# EAGLE design MTX_Tap_an_er_V13_Nopoti_2018_11_30 (EAGLE 7.5.0)

## Sheet 1 of 2
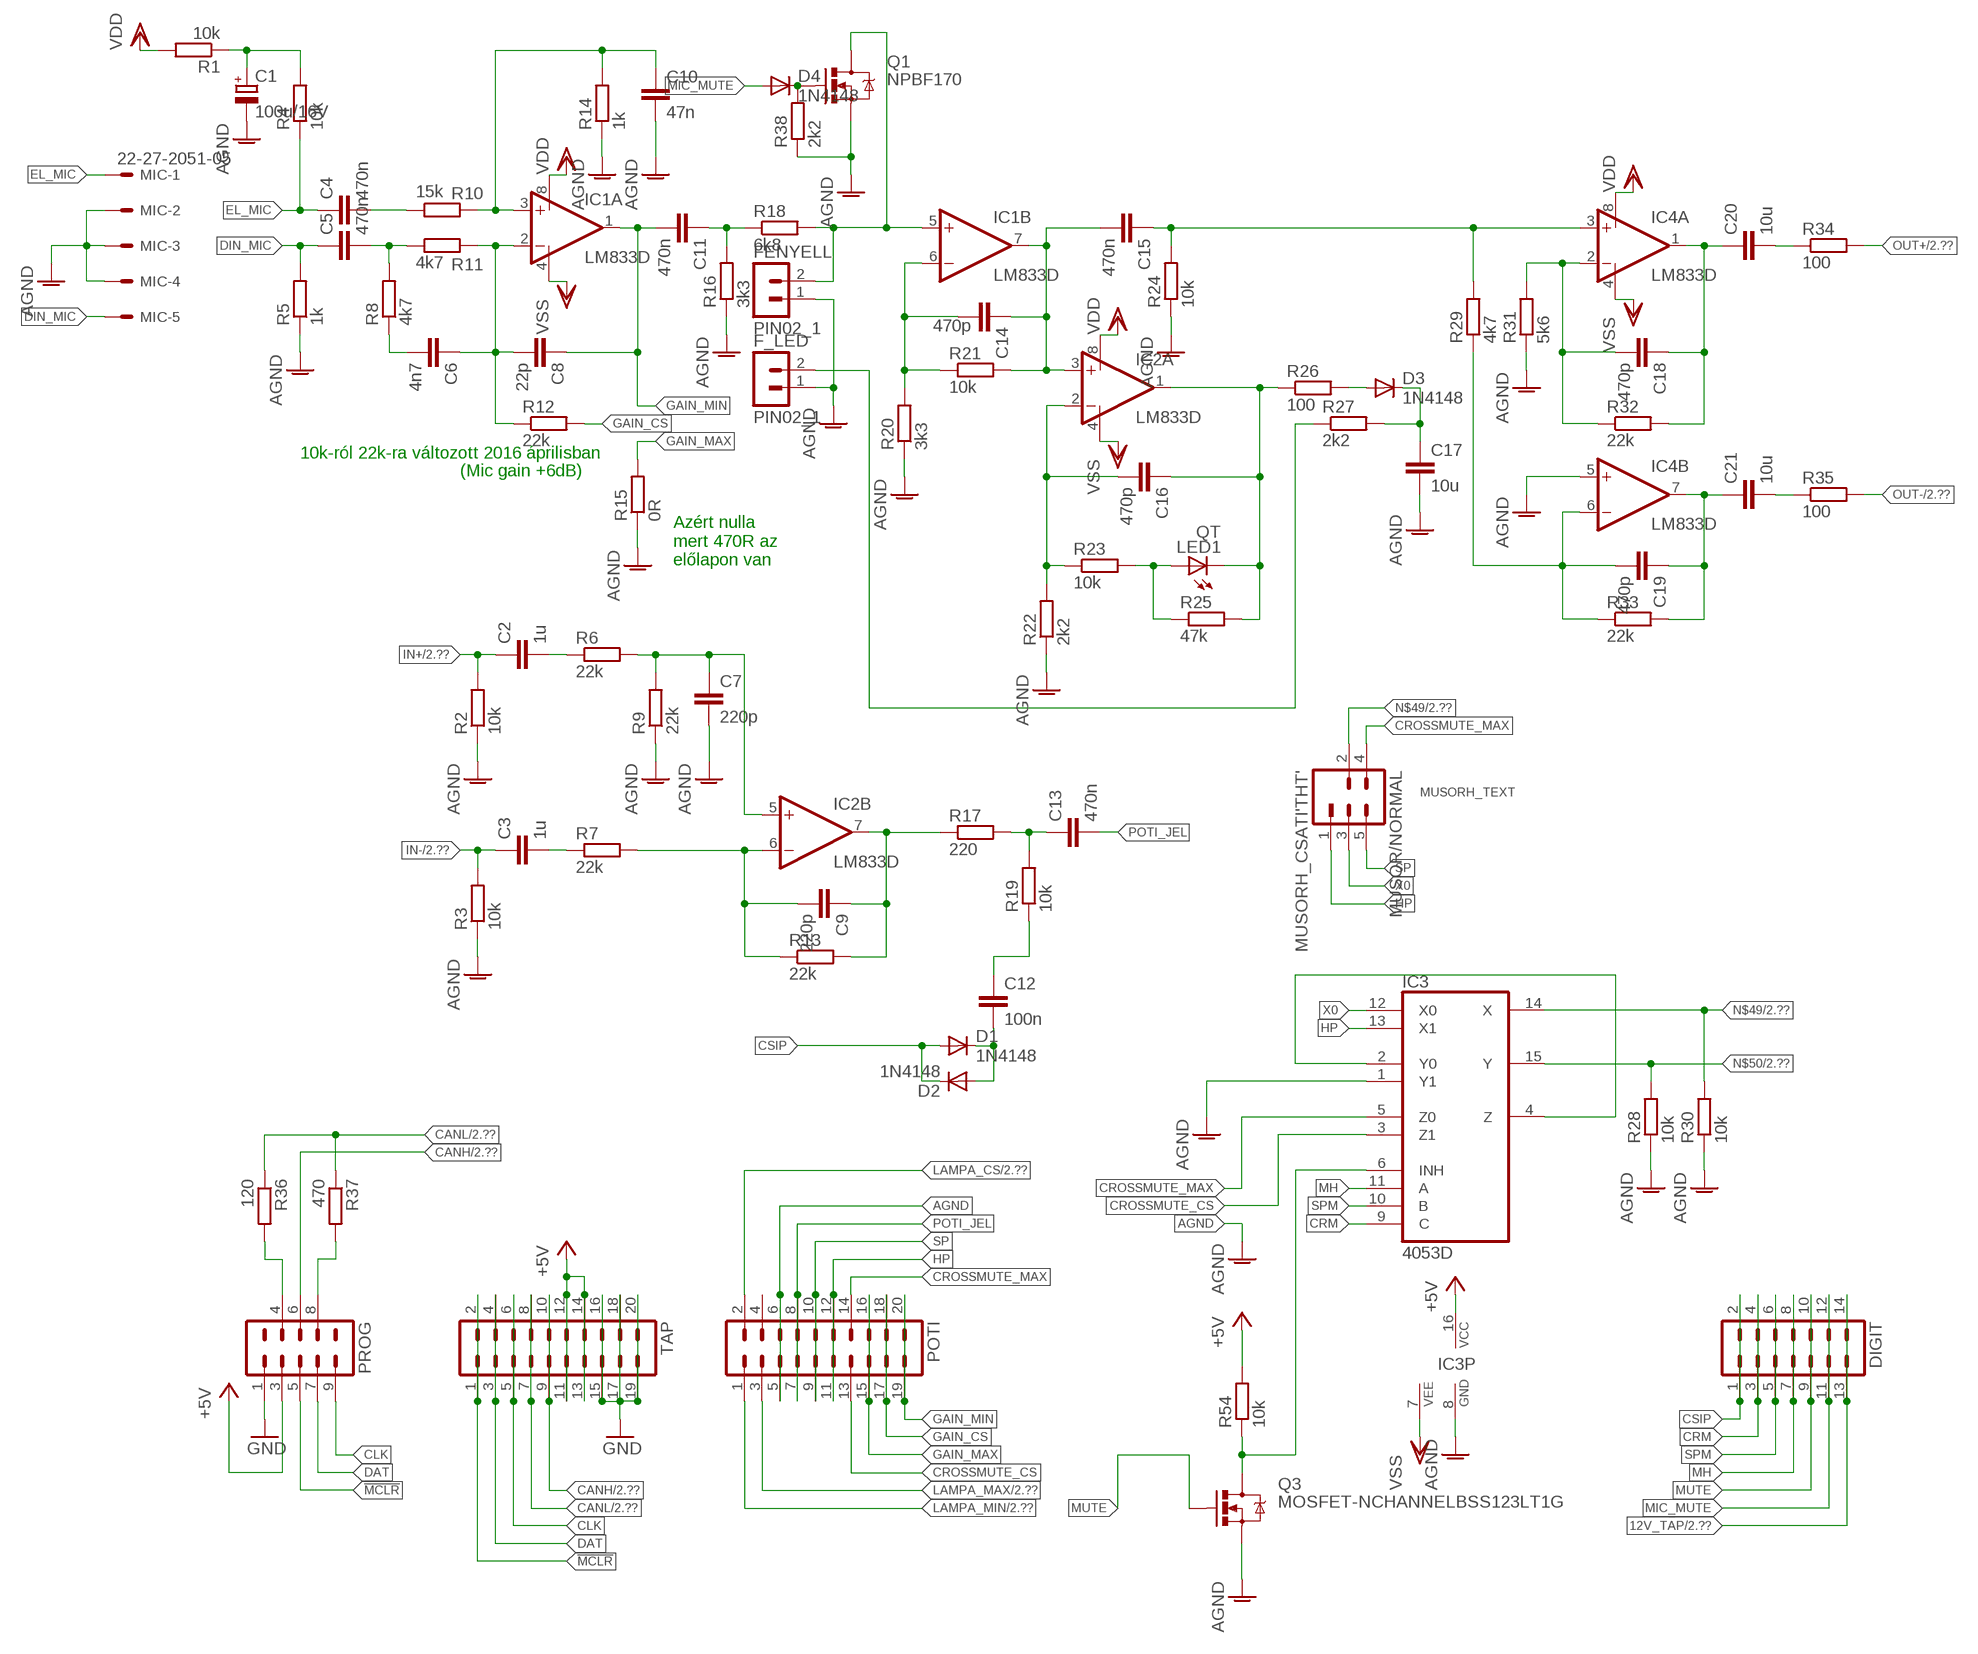
[diagram p0: schematic, sheet 1]

### Parts
C1  100u/16V  CPOL-EUE2.5-5  [E2,5-5]
C2  1u  C-EUC0805  [C0805]
C3  1u  C-EUC0805  [C0805]
C4  470n  C-EUC0805  [C0805]
C5  470n  C-EUC0805  [C0805]
C6  4n7  C-EUC0805  [C0805]
C7  220p  C-EUC0805  [C0805]
C8  22p  C-EUC0805  [C0805]
C9  220p  C-EUC0805  [C0805]
C10  47n  C-EUC0805  [C0805]
C11  470n  C-EUC0805  [C0805]
C12  100n  C-EUC0805  [C0805]
C13  470n  C-EUC0805  [C0805]
C14  470p  C-EUC0805  [C0805]
C15  470n  C-EUC0805  [C0805]
C16  470p  C-EUC0805  [C0805]
C17  10u  C-EUC0805  [C0805]
C18  470p  C-EUC0805  [C0805]
C19  470p  C-EUC0805  [C0805]
C20  10u  C-EUC0805  [C0805]
C21  10u  C-EUC0805  [C0805]
D1  1N4148  DIODE-SOD80C  [SOD80C]
D2  1N4148  DIODE-SOD80C  [SOD80C]
D3  1N4148  DIODE-SOD80C  [SOD80C]
D4  1N4148  DIODE-SOD80C  [SOD80C]
DIGIT  MA07-2  [MA07-2]
F_LED  PIN02_1  [PIN02_1]
FENYELL  PIN02_1  [PIN02_1]
IC1  LM833D  [SO08]
IC2  LM833D  [SO08]
IC3  4053D  [SO16]
IC4  LM833D  [SO08]
LED1  QT  LED3MM  [LED3MM]
MIC  22-27-2051-05  [6410-05]
MUSOR/NORMAL  MUSORH_CSATI'THT'  [MUSORH_CSATI]
POTI  MA10-2  [MA10-2]
PROG  CN_CANTAN  [CN_CANTAN]
Q1  NPBF170  MOSFET-NCHANNELBSS138  [SOT23]
Q3  MOSFET-NCHANNELBSS123LT1G  [SOT23]
R1  10k  R-EU_R0805  [R0805]
R2  10k  R-EU_R0805  [R0805]
R3  10k  R-EU_R0805  [R0805]
R4  10k  R-EU_R0805  [R0805]
R5  1k  R-EU_R0805  [R0805]
R6  22k  R-EU_R0805  [R0805]
R7  22k  R-EU_R0805  [R0805]
R8  4k7  R-EU_R0805  [R0805]
R9  22k  R-EU_R0805  [R0805]
R10  15k  R-EU_R0805  [R0805]
R11  4k7  R-EU_R0805  [R0805]
R12  22k  R-EU_R0805  [R0805]
R13  22k  R-EU_R0805  [R0805]
R14  1k  R-EU_R0805  [R0805]
R15  0R  R-EU_R0805  [R0805]
R16  3k3  R-EU_R0805  [R0805]
R17  220  R-EU_R0805  [R0805]
R18  6k8  R-EU_R0805  [R0805]
R19  10k  R-EU_R0805  [R0805]
R20  3k3  R-EU_R0805  [R0805]
R21  10k  R-EU_R0805  [R0805]
R22  2k2  R-EU_R0805  [R0805]
R23  10k  R-EU_R0805  [R0805]
R24  10k  R-EU_R0805  [R0805]
R25  47k  R-EU_R0805  [R0805]
R26  100  R-EU_R0805  [R0805]
R27  2k2  R-EU_R0805  [R0805]
R28  10k  R-EU_R0805  [R0805]
R29  4k7  R-EU_R0805  [R0805]
R30  10k  R-EU_R0805  [R0805]
R31  5k6  R-EU_R0805  [R0805]
R32  22k  R-EU_R0805  [R0805]
R33  22k  R-EU_R0805  [R0805]
R34  100  R-EU_R0805  [R0805]
R35  100  R-EU_R0805  [R0805]
R36  120  R-EU_R0805  [R0805]
R37  470  R-EU_R0805  [R0805]
R38  2k2  R-EU_R0805  [R0805]
R54  10k  R-EU_R0805  [R0805]
TAP  MA10-2  [MA10-2]
U$1  MUSORH_TEXT  [MUSORH_TEXT]

### Nets
1.: C9.1 IC2.7(B:OUT) R13.2 R17.1
12V_TAP: DIGIT.13 DIGIT.14 ; also sheet 2
!MCLR: PROG.5 TAP.1 TAP.2
+5V: IC3.16(VCC) PROG.3 R54.2 TAP.11 TAP.12 TAP.13 TAP.14 ; also sheet 2
AGND: C1.- C7.2 C10.2 C17.2 F_LED.1 FENYELL.1 IC3.1(Y1) IC3.8(GND) IC4.5(B:+IN) MIC.2 MIC.3 MIC.4 POTI.5 POTI.6 Q1.2(S) Q3.2(S) R2.1 R3.1 R5.1 R9.1 R14.1 R15.1 R16.1 R20.1 R22.1 R24.1 R28.1 R30.1 R31.1 R38.1 ; also sheet 2
CANH: PROG.6 TAP.9 TAP.10 ; also sheet 2
CANL: R36.1 R37.1 TAP.7 TAP.8 ; also sheet 2
CLK: PROG.9 TAP.5 TAP.6
CRM: DIGIT.3 DIGIT.4 IC3.9(C)
CROSSMUTE_CS: IC3.3(Z1) POTI.13
CROSSMUTE_MAX: IC3.5(Z0) MUSOR/NORMAL.4 POTI.14
CSIP: D1.A D2.C DIGIT.1 DIGIT.2
DAT: PROG.7 TAP.3 TAP.4
DIN_MIC: C5.1 MIC.5 R5.2
EL_MIC: C4.1 MIC.1 R4.1
GAIN_CS: POTI.17 POTI.18 R12.2
GAIN_MAX: POTI.15 POTI.16 R15.2
GAIN_MIN: C8.1 C11.2 IC1.1(A:OUT) POTI.19 POTI.20
GND: PROG.1 TAP.15 TAP.16 TAP.17 TAP.18 TAP.19 TAP.20 ; also sheet 2
HP: IC3.13(X1) MUSOR/NORMAL.1 POTI.11 POTI.12
IN+: C2.1 R2.2 ; also sheet 2
IN-: C3.1 R3.2 ; also sheet 2
LAMPA_CS: POTI.2 ; also sheet 2
LAMPA_MAX: POTI.3 ; also sheet 2
LAMPA_MIN: POTI.1 ; also sheet 2
MH: DIGIT.7 DIGIT.8 IC3.11(A)
MIC_MUTE: D4.A DIGIT.11 DIGIT.12
MUTE: DIGIT.9 DIGIT.10 Q3.1(G)
N$1: C1.+ R1.1 R4.2
N$2: C4.2 R10.1
N$3: C5.2 R8.2 R11.1
N$4: C10.1 IC1.3(A:+IN) R10.2 R14.2
N$5: C6.1 C8.2 IC1.2(A:-IN) R11.2 R12.1
N$8: C6.2 R8.1
N$9: FENYELL.2 IC1.5(B:+IN) Q1.3(D) R18.2
N$12: IC3.2(Y0) IC3.4(Z)
N$13: C11.1 R16.2 R18.1
N$14: C18.2 IC4.2(A:-IN) R31.2 R32.1
N$15: C18.1 C20.1 IC4.1(A:OUT) R32.2
N$16: C14.2 IC1.6(B:-IN) R20.2 R21.1
N$17: C14.1 C15.2 IC1.7(B:OUT) IC2.3(A:+IN) R21.2
N$18: C16.2 IC2.2(A:-IN) R22.2 R23.1
N$19: C19.2 IC4.6(B:-IN) R29.1 R33.1
N$20: LED1.A R23.2 R25.1
N$21: C16.1 IC2.1(A:OUT) LED1.K(C) R25.2 R26.1
N$22: D3.A R26.2
N$23: C17.1 D3.C R27.2
N$24: F_LED.2 R27.1
N$25: C15.1 IC4.3(A:+IN) R24.2 R29.2
N$26: C19.1 C21.1 IC4.7(B:OUT) R33.2
N$27: C21.2 R35.1
N$28: C20.2 R34.1
N$29: C2.2 R6.1
N$30: D4.C Q1.1(G) R38.2
N$31: C7.1 IC2.5(B:+IN) R6.2 R9.2
N$32: C3.2 R7.1
N$35: C12.2 D1.C D2.A
N$36: C9.2 IC2.6(B:-IN) R7.2 R13.1
N$39: C13.1 R17.2 R19.2
N$40: C12.1 R19.1
N$49: IC3.14(X) MUSOR/NORMAL.2 R30.2 ; also sheet 2
N$50: IC3.15(Y) R28.2 ; also sheet 2
N$51: PROG.8 R37.2
N$57: PROG.4 R36.2
N$59: IC3.6(INH) Q3.3(D) R54.1
OUT+: R34.2 ; also sheet 2
OUT-: R35.2 ; also sheet 2
POTI_JEL: C13.2 POTI.7 POTI.8
SP: MUSOR/NORMAL.5 POTI.9 POTI.10
SPM: DIGIT.5 DIGIT.6 IC3.10(B)
VDD: IC1.8(P:V+) IC2.8(P:V+) IC4.8(P:V+) R1.2 ; also sheet 2
VSS: IC1.4(P:V-) IC2.4(P:V-) IC3.7(VEE) IC4.4(P:V-) ; also sheet 2
X0: IC3.12(X0) MUSOR/NORMAL.3
Unconnected: POTI.4

### Notes on the sheet
- 10k-ról 22k-ra változott 2016 áprilisban
- (Mic gain +6dB)
- Azért nulla
  mert 470R az 
  előlapon van

## Sheet 2 of 2
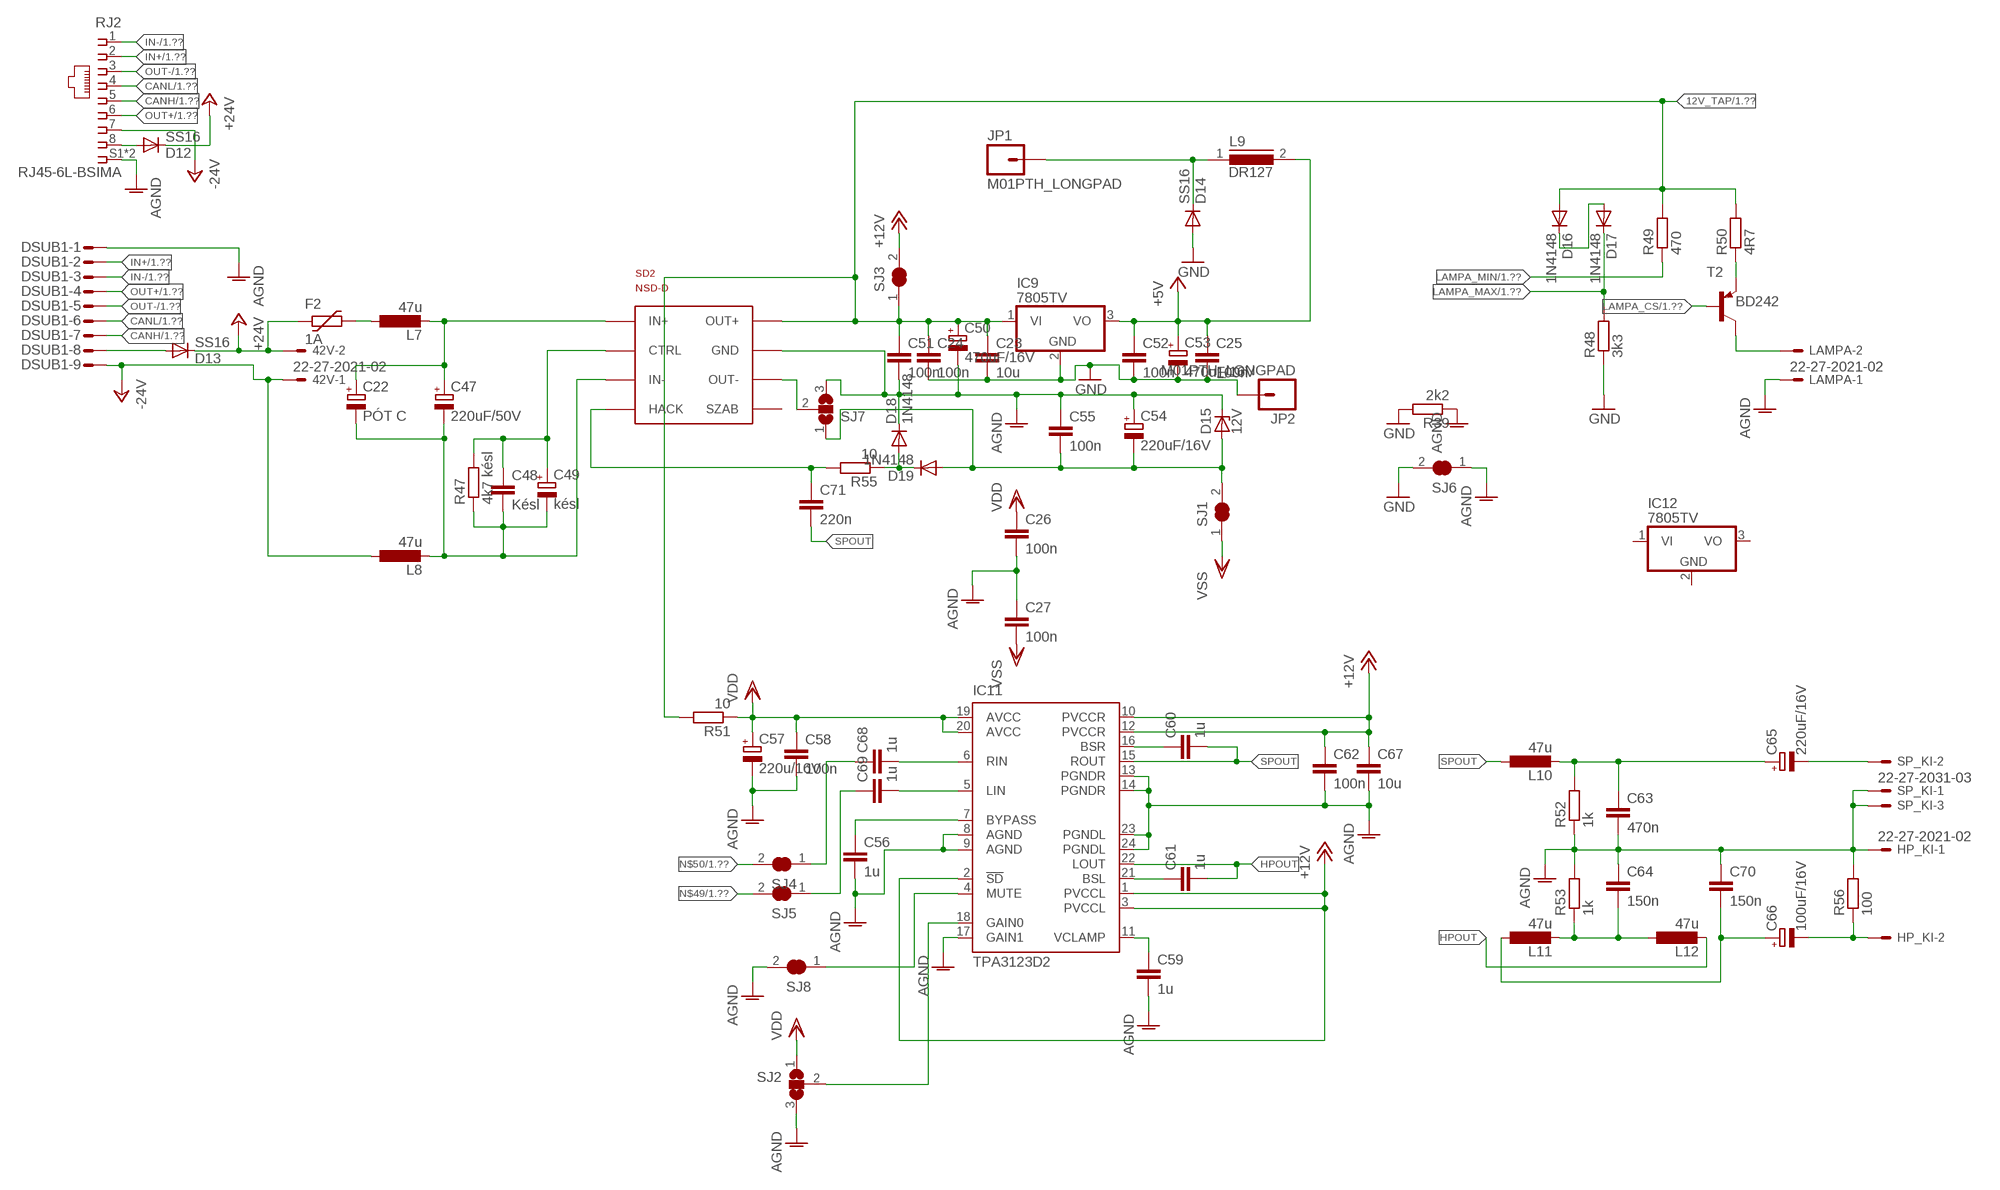
[diagram p1: schematic, sheet 2]

### Parts
42V  22-27-2021-02  [6410-02]
C22  PÓT C  CPOL-EUE3.5-8  [E3,5-8]
C23  10u  C-EUC0805  [C0805]
C24  100n  C-EUC0805  [C0805]
C25  100n  C-EUC0805  [C0805]
C26  100n  C-EUC0805  [C0805]
C27  100n  C-EUC0805  [C0805]
C47  220uF/50V  CPOL-EUE3.5-8  [E3,5-8]
C48  Késl  C-EUC0805  [C0805]
C49  késl  CPOL-EUE2.5-5  [E2,5-5]
C50  470uF/16V  CPOL-EUE3.5-8  [E3,5-8]
C51  100n  C-EUC0805  [C0805]
C52  100n  C-EUC0805  [C0805]
C53  470uF/16V  CPOL-EUE3.5-8  [E3,5-8]
C54  220uF/16V  CPOL-EUE2.5-7  [E2,5-7]
C55  100n  C-EUC0805  [C0805]
C56  1u  C-EUC0805  [C0805]
C57  220u/16V  CPOL-EUE2.5-7  [E2,5-7]
C58  100n  C-EUC0805  [C0805]
C59  1u  C-EUC0805  [C0805]
C60  1u  C-EUC0805  [C0805]
C61  1u  C-EUC0805  [C0805]
C62  100n  C-EUC0805  [C0805]
C63  470n  C-EUC0805  [C0805]
C64  150n  C-EUC0805  [C0805]
C65  220uF/16V  CPOL-EUE2.5-7  [E2,5-7]
C66  100uF/16V  CPOL-EUE2.5-6  [E2,5-6]
C67  10u  C-EUC0805  [C0805]
C68  1u  C-EUC0805  [C0805]
C69  1u  C-EUC0805  [C0805]
C70  150n  C-EUC0805  [C0805]
C71  220n  C-EUC0805  [C0805]
D12  SS16  DIODE-DO-214AC  [DO-214AC]
D13  SS16  DIODE-DO-214AC  [DO-214AC]
D14  SS16  DIODE-DO-214AC  [DO-214AC]
D15  12V  ZENER-DIODESOD80C  [SOD80C]
D16  1N4148  DIODE-SOD80C  [SOD80C]
D17  1N4148  DIODE-SOD80C  [SOD80C]
D18  1N4148  DIODE-SOD80C  [SOD80C]
D19  1N4148  DIODE-SOD80C  [SOD80C]
DSUB1  M09-182S  [182-009-MALE]
F2  1A  FUSE_PTC-1812  [PTC1812L]
HP_KI  22-27-2021-02  [6410-02]
IC9  7805TV  [TO220V]
IC11  TPA3123D2  [PWP-TSSOP24]
IC12  7805TV  [TO220V]
JP1  M01PTH_LONGPAD  [1X01_LONGPAD]
JP2  M01PTH_LONGPAD  [1X01_LONGPAD]
L7  47u  L-EUPIS2816  [PIS2816]
L8  47u  L-EUPIS2816  [PIS2816]
L9  DR127  [DR127]
L10  47u  L-EUPIS2816  [PIS2816]
L11  47u  L-EUPIS2816  [PIS2816]
L12  47u  L-EUPIS2816  [PIS2816]
LAMPA  22-27-2021-02  [6410-02]
R39  2k2  R-EU_R0805  [R0805]
R47  4k7 késl  R-EU_R0805  [R0805]
R48  3k3  R-EU_R0805  [R0805]
R49  470  R-EU_R0805  [R0805]
R50  4R7  R-EU_R0805  [R0805]
R51  10  R-EU_R1210  [R1210]
R52  1k  R-EU_R0805  [R0805]
R53  1k  R-EU_R0805  [R0805]
R55  10  R-EU_R0805  [R0805]
R56  100  R-EU_R0805  [R0805]
RJ2  RJ45-6L-BSIMA  [RJ45]
SD2  NSD-D  [NSD-D]
SJ1  SOLDERJUMPER_CLOSED  [SOLDERJUMPER_CLOSEDWIRE]
SJ2  SJ2WW12  [SJ_2W_12]
SJ3  SOLDERJUMPER_CLOSED  [SOLDERJUMPER_CLOSEDWIRE]
SJ4  SOLDERJUMPER_CLOSED  [SOLDERJUMPER_CLOSEDWIRE]
SJ5  SOLDERJUMPER_CLOSED  [SOLDERJUMPER_CLOSEDWIRE]
SJ6  SOLDERJUMPER_CLOSED  [SOLDERJUMPER_CLOSEDWIRE]
SJ7  SJ2WW23  [SJ_2W_23]
SJ8  SOLDERJUMPER_CLOSED  [SOLDERJUMPER_CLOSEDWIRE]
SP_KI  22-27-2031-03  [6410-03]
T2  BD242  -PNP-TO220V  [TO220V]

### Nets
12V_TAP: C23.1 C24.1 C50.+ C51.1 D16.A IC9.1(VI) R49.2 R50.2 R51.2 SD2.OUT+ SJ3.1 ; also sheet 1
+5V: C25.1 C52.1 C53.+ IC9.3(VO) L9.2 ; also sheet 1
+12V: C62.1 C67.1 IC11.1(PVCCL) IC11.2(!SD) IC11.3(PVCCL) IC11.10(PVCCR) IC11.12(PVCCR) SJ3.2
+24V: 42V.2 D12.1(C) D13.1(C) F2.1
-24V: 42V.1 DSUB1.9 L8.1 RJ2.7
AGND: C26.2 C27.1 C50.- C51.2 C54.+ C55.1 C56.2 C57.- C58.2 C59.2 C62.2 C63.2 C64.1 C67.2 C70.1 D15.C D18.C DSUB1.1 HP_KI.1 IC11.8(AGND) IC11.9(AGND) IC11.13(PGNDR) IC11.14(PGNDR) IC11.17(GAIN1) IC11.23(PGNDL) IC11.24(PGNDL) LAMPA.1 R39.1 R52.1 R53.2 R56.2 RJ2.S1(S) RJ2.S2(S) SD2.COMMON(GND) SJ2.3 SJ6.1 SJ7.3 SJ8.2 SP_KI.1 SP_KI.3 ; also sheet 1
CANH: DSUB1.7 RJ2.5 ; also sheet 1
CANL: DSUB1.6 RJ2.4 ; also sheet 1
GND: C23.2 C24.2 C25.2 C52.2 C53.- D14.2(A) IC9.2(GND) JP2.1 R39.2 R48.1 SJ6.2 ; also sheet 1
HPIN_X: C69.1 SJ5.1
HPOUT: C61.2 IC11.22(LOUT) L12.2
IN+: DSUB1.2 RJ2.2 ; also sheet 1
IN-: DSUB1.3 RJ2.1 ; also sheet 1
LAMPA_CS: T2.1(B) ; also sheet 1
LAMPA_MAX: D17.C R48.2 ; also sheet 1
LAMPA_MIN: R49.1 ; also sheet 1
N$6: C54.- C55.2 D15.A D19.A SJ1.2 SJ7.1
N$7: D12.2(A) RJ2.8
N$34: C65.- SP_KI.2
N$46: SD2.OUT- SJ7.2
N$49: SJ5.2 ; also sheet 1
N$50: SJ4.2 ; also sheet 1
N$55: C71.1 R55.2 SD2.HACK
N$71: D13.2(A) DSUB1.8
N$72: F2.2 L7.1
N$74: C22.+ C47.+ L7.2 SD2.INPUT+(IN+)
N$75: C48.1 C49.+ R47.2 SD2.CONTROL(CTRL)
N$76: C22.- C47.- C48.2 C49.- L8.2 R47.1 SD2.INPUT-(IN-)
N$77: D14.1(C) JP1.1 L9.1
N$78: R50.1 T2.3(E)
N$80: D16.C D17.A
N$81: LAMPA.2 T2.2(C)
N$82: C56.1 IC11.7(BYPASS)
N$83: C59.1 IC11.11(VCLAMP)
N$84: C61.1 IC11.21(BSL)
N$85: C60.1 IC11.16(BSR)
N$86: C63.1 C65.+ L10.2 R52.2
N$87: C64.2 L11.2 L12.1 R53.1
N$89: C66.- HP_KI.2 R56.1
N$90: C68.2 IC11.6(RIN)
N$91: C69.2 IC11.5(LIN)
N$92: IC11.18(GAIN0) SJ2.2
N$93: IC11.4(MUTE) SJ8.1
N$94: D18.A D19.C R55.1
N$95: C66.+ C70.2 L11.1
OUT+: DSUB1.4 RJ2.6 ; also sheet 1
OUT-: DSUB1.5 RJ2.3 ; also sheet 1
SPIN_X: C68.1 SJ4.1
SPOUT: C60.2 C71.2 IC11.15(ROUT) L10.1
VDD: C26.1 C57.+ C58.1 IC11.19(AVCC) IC11.20(AVCC) R51.1 SJ2.1 ; also sheet 1
VSS: C27.2 SJ1.1 ; also sheet 1
Unconnected: IC12.1(VI) IC12.2(GND) IC12.3(VO) SD2.SZAB

## Library data of the parts
42V HP_KI LAMPA = con-molex:22-?-02: CONNECTOR wire to board 2.54 mm (.1 inch) pitch header; OC_FARNELL: unknown; OC_NEWARK: unknown
C1 C22 C47 C49 C50 C53 C54 C57 C65 C66 = rcl:CPOL-EU: POLARIZED CAPACITOR, European symbol
C2-C21 C23-C27 C48 C51 C52 C55 C56 C58-C64 C67-C71 = rcl:C-EU: CAPACITOR, European symbol
D1-D4 D16-D19 = diode:DIODE-: DIODE
D12-D14 = dp_devices:DIODE: Various Diode Packages
D15 = diode:ZENER-DIODE: Z-Diode
DIGIT = con-lstb:MA07-2: PIN HEADER; OC_FARNELL: unknown; OC_NEWARK: unknown
DSUB1 = con-subd:M09?S: SUB-D; OC_FARNELL: unknown; OC_NEWARK: unknown
F2 = dp_devices:FUSE_PTC: Resettable PTC; TME: BSMD-T1.0A
F_LED FENYELL = Cf_Csatl:PIN02_1
IC1 IC2 IC4 = linear:LM833: OP AMP
IC3 = 40xx:4053: Triple 2-channel ANALOG MULTIPLEXER
IC9 IC12 = linear:78*: Positive VOLTAGE REGULATOR Source: http://cache.national.com/ds/LM/LM78L05.pdf http://www.fairchildsemi.com/ds/LM/LM7805.pdf
IC11 = texas:TPA3123D2: 25-W STEREO CLASS-D AUDIO POWER AMPLIFIER Please INVOKE gate EXP, set DRC-Clearance | Same signals | SMD - SMD = 0 Source: http://focus.ti.com/lit/ds/symlink/tpa3123d2.pdf; MPN: TPA3123D2PWP; OC_FARNELL: 1632099; OC_NEWARK: 53M3994
JP1 JP2 = SparkFun-Connectors:M01: Header 1 Standard 1-pin 0.1" header. Use with straight break away headers (SKU : PRT-00116), right angle break away headers (PRT-00553), swiss pins (PRT-00743), machine pins (PRT-00117), and female headers (PRT-00115).
L7 L8 L10-L12 = rcl:L-EU: INDUCTOR, European symbol
L9 = inductors:DR127: High Power Density, High Efficiency, Shielded Inductors Source: coiltronics_dr_series.pdf
LED1 = led:LED: LED OSRAM: - CHIPLED LG R971, LG N971, LY N971, LG Q971, LY Q971, LO R971, LY R971 LH N974, LH R974 LS Q976, LO Q976, LY Q976 LO Q996 - Hyper CHIPLED LW Q18S LB Q993, LB Q99A, LB R99A - SideLED LS A670, LO A670, LY A670, LG A670, LP A670 LB A673, LV A673, LT A673, LW A673 LH A674 LY A675 LS A676, LA A676, LO A676, LY A676, LW A676 LS A679, LY A679, LG A679 - Hyper Micro SIDELED® LS Y876, LA Y876, LO Y876, LY Y876 LT Y87S - SmartLED LW L88C, LW L88S LB L89C, LB L89S, LG L890 LS L89K, LO L89K, LY L89K LS L896, LA L896, LO L896, LY L896 - TOPLED LS T670, LO T670, LY T670, LG T670, LP T670 LSG T670, LSP T670, LSY T670, LOP T670, LYG T670 LG T671, LOG T671, LSG T671 LB T673, LV T673, LT T673, LW T673 LH T674 LS T676, LA T676, LO T676, LY T676, LB T676, LH T676, LSB T676, LW T676 LB T67C, LV T67C, LT T67C, LS T67K, LO T67K, LY T67K, LW E67C LS E67B, LA E67B, LO E67B, LY E67B, LB E67C, LV E67C, LT E67C LW T67C LS T679, LY T679, LG T679 LS T770, LO T770, LY T770, LG T770, LP T770 LB T773, LV T773, LT T773, LW T773 LH T774 LS E675, LA E675, LY E675, LS T675 LS T776, LA T776, LO T776, LY T776, LB T776 LHGB T686 LT T68C, LB T68C - Hyper Mini TOPLED® LB M676 - Mini TOPLED Santana® LG M470 LS M47K, LO M47K, LY M47K Source: http://www.osram.convergy.de LUXEON: - LUMILED® LXK2-PW12-R00, LXK2-PW12-S00, LXK2-PW14-U00, LXK2-PW14-V00 LXK2-PM12-R00, LXK2-PM12-S00, LXK2-PM14-U00 LXK2-PE12-Q00, LXK2-PE12-R00, LXK2-PE12-S00, LXK2-PE14-T00, LXK2-PE14-U00 LXK2-PB12-K00, LXK2-PB12-L00, LXK2-PB12-M00, LXK2-PB14-N00, LXK2-PB14-P00, LXK2-PB14-Q00 LXK2-PR12-L00, LXK2-PR12-M00, LXK2-PR14-Q00, LXK2-PR14-R00 LXK2-PD12-Q00, LXK2-PD12-R00, LXK2-PD12-S00 LXK2-PH12-R00, LXK2-PH12-S00 LXK2-PL12-P00, LXK2-PL12-Q00, LXK2-PL12-R00 Source: www.luxeon.com KINGBRIGHT: KA-3528ASYC Source: www.kingbright.com
MIC = con-molex:22-?-05: CONNECTOR wire to board 2.54 mm (.1 inch) pitch header; OC_FARNELL: unknown; OC_NEWARK: unknown
MUSOR/NORMAL = narval:MUSORH_CSATI
POTI TAP = con-lstb:MA10-2: PIN HEADER; OC_FARNELL: unknown; OC_NEWARK: unknown
PROG = narval:CN_CANTAN: HARTING
Q1 = SparkFun-DiscreteSemi:MOSFET-NCHANNEL: Common NMOSFET Parts MFG P/N Store ID Prod ID FDD8780 TRANS-09984 SI7820DN TRANS-11055 FDS6630A IC-08089 2N7002PW TRANS-11151 FQP30N06L COM-10213 TRANS-10060 BSS123LT1G TRANS-08345 BSS138 TRANS-00830 BS170 2N7000; PROD_ID: TRANS-00830
Q3 = SparkFun-DiscreteSemi:MOSFET-NCHANNEL: Common NMOSFET Parts MFG P/N Store ID Prod ID FDD8780 TRANS-09984 SI7820DN TRANS-11055 FDS6630A IC-08089 2N7002PW TRANS-11151 FQP30N06L COM-10213 TRANS-10060 BSS123LT1G TRANS-08345 BSS138 TRANS-00830 BS170 2N7000; PROD_ID: TRANS-08345
R1-R39 R47-R56 = rcl:R-EU_: RESISTOR, European symbol
RJ2 = Cf_Csatl:RJ45: CORCOM Modular RJ Jacks No Shield Source: www.tycoelectronics.com .. ENG_DS_1654001_1099_RJ_L_0507.pdf; MPN: RJ45-6L-B; OC_FARNELL: unknown; OC_NEWARK: 16R6090
SD2 = meanwell:NSD-D
SJ1 SJ3-SJ6 SJ8 = microbuilder:SOLDERJUMPER_CLOSED: Solder Jumper - Closed These solder jumpers are closed by default CLOSEDWIRE - 10 mil trace between pads that can be cut and resoldered later CLOSEDPERM - 63 mil trace between pads for a permanent connection (used to 'bridge' two signals, a shameless hack for Eagle). Can double as a test point as well (no cream layer)
SJ2 SJ7 = jumper:SJ2W: SMD solder JUMPER
SP_KI = con-molex:22-?-03: CONNECTOR wire to board 2.54 mm (.1 inch) pitch header; OC_FARNELL: unknown; OC_NEWARK: unknown
T2 = transistor:*-PNP-: PNP Transistror
U$1 = narval:MUSORH_TEXT

## Board
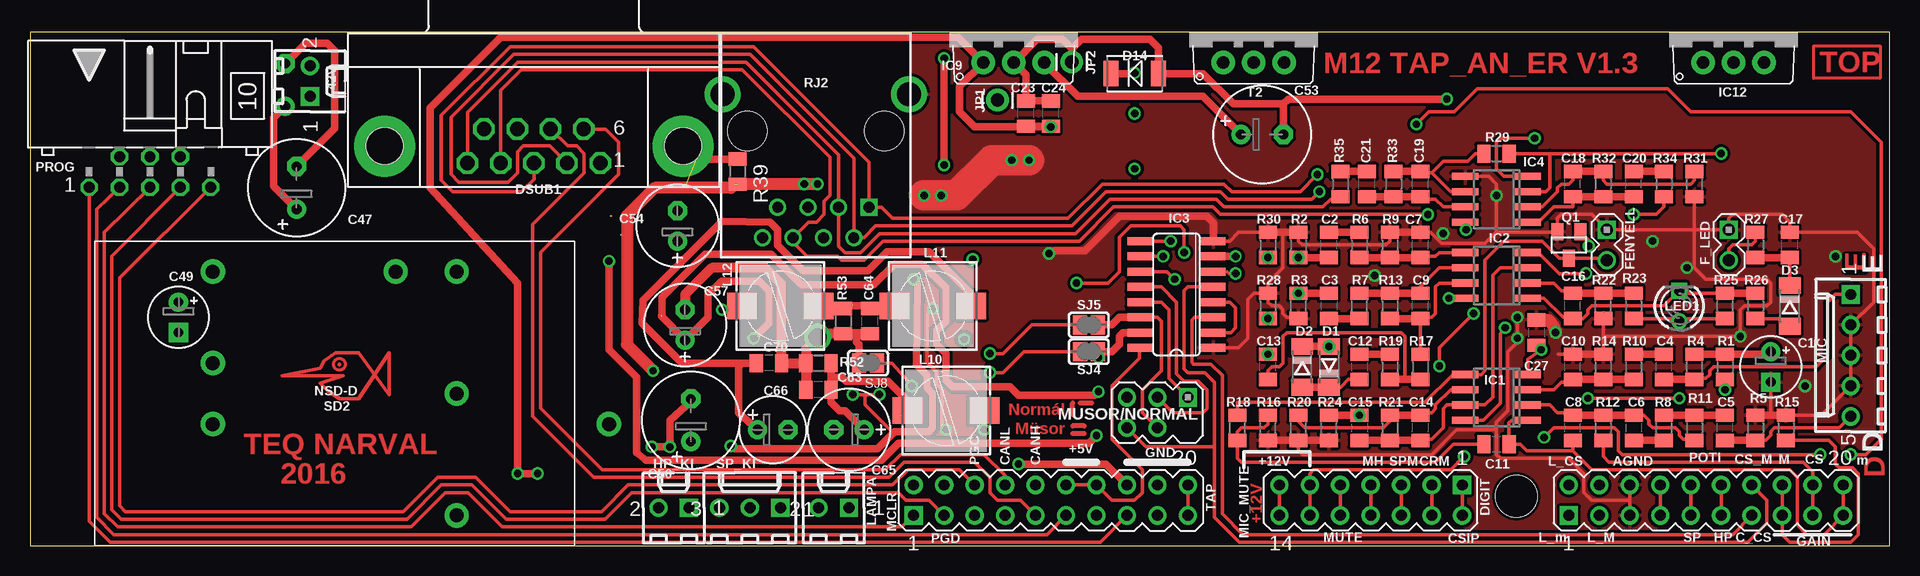
[diagram p2: board, top side]
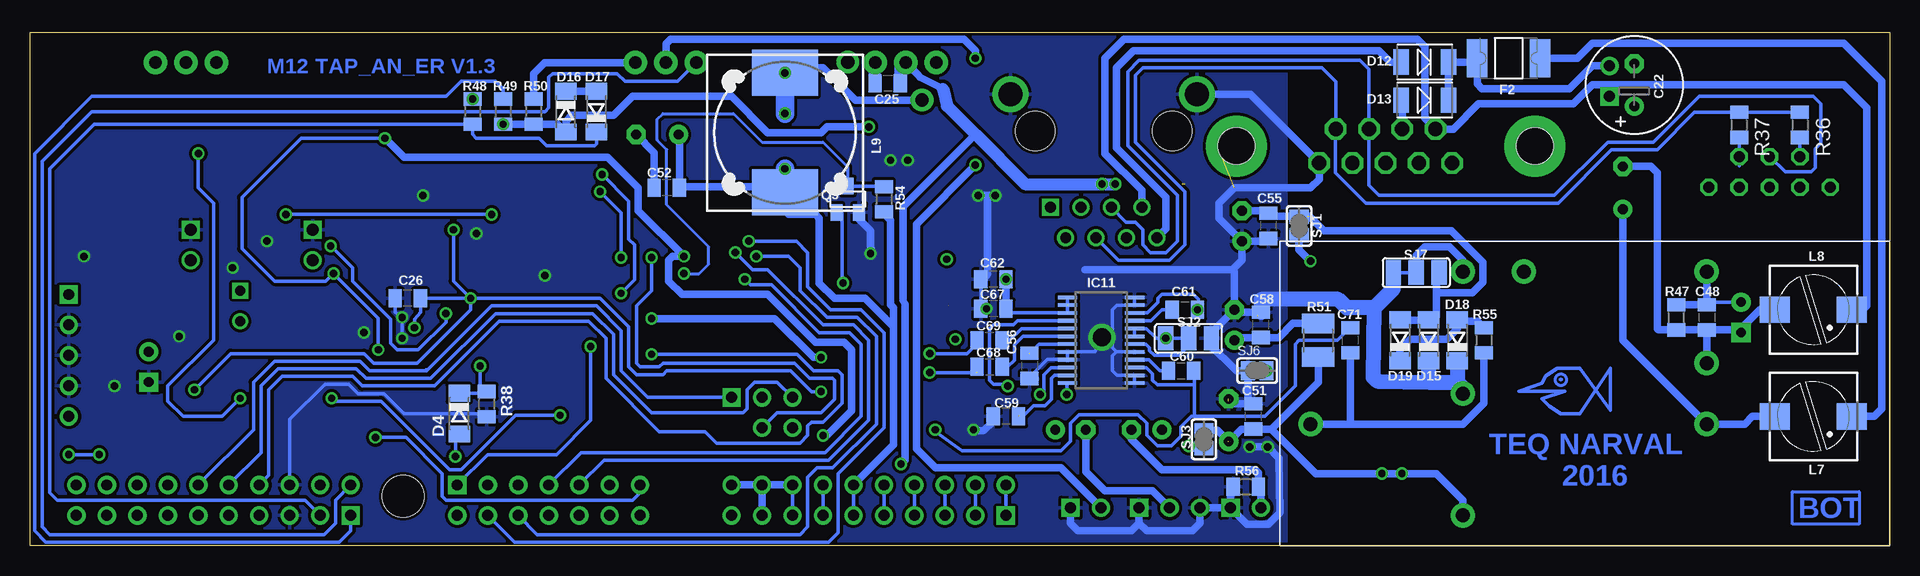
[diagram p3: board, bottom side, seen from below]

Size 155 x 42.83 mm. Coordinates in mm from the lower left corner, seen from the top.
Outline: 0,0 155,0 155,42.83 0,42.83 0,0
Copper layers (1*16): Top 0.035mm / dielectric 1.5mm / Bottom 0.035mm
Design rules "default": minimum track width 10mil, minimum drill 24mil, track to track 10mil, track to pad 10mil, pad to pad 10mil, via to via 10mil, smd to smd 10mil, copper to edge 10mil, drill to drill 10mil, minimum pad ring 10mil, minimum via ring 8mil, stop-mask expansion 4mil, vias tented up to drill 0mil, thermal gap 10mil
Holes 3.5 mm at 123.91,4.13

### Footprints (pad centres in the part's own frame; a part is rotated, then mirrored left to right if it is on the bottom)
6410-02 = drill 0.914 pad 1.524 square: 1 1.27,0 | drill 0.914 pad 1.524: 2 -1.27,0
E2,5-5 = drill 0.813 pad 1.6: + -1.27,0 | drill 0.813 pad 1.6 square: - 1.27,0
C0805 = smd 1.1 x 1.5: 1 -1.05,0; 2 1.05,0
E3,5-8 = drill 0.813 pad 1.6: + -1.778,0 | drill 0.813 pad 1.6 octagon: - 1.778,0
E2,5-7 = drill 0.813 pad 1.6: + -1.27,0 | drill 0.813 pad 1.6 octagon: - 1.27,0
E2,5-6 = drill 0.813 pad 1.6: + -1.27,0 | drill 0.813 pad 1.6 octagon: - 1.27,0
SOD80C = smd 1.4 x 1.8: A 1.7,0; C -1.7,0
DO-214AC = smd 1.27 x 2.1: 1 -1.98,0; 2 1.98,0
MA07-2 = drill 0.914 pad 1.524 square: 1 -7.62,-1.27 | drill 0.914 pad 1.524: 2 -7.62,1.27; 3 -5.08,-1.27; 4 -5.08,1.27; 5 -2.54,-1.27; 6 -2.54,1.27; 7 0,-1.27; 8 0,1.27; 9 2.54,-1.27; 10 2.54,1.27; 11 5.08,-1.27; 12 5.08,1.27; 13 7.62,-1.27; 14 7.62,1.27
182-009-MALE = drill 1.194 pad 1.524 octagon: 1 -5.537,10.923; 2 -2.769,10.923; 3 0,10.923; 4 2.769,10.923; 5 5.537,10.923; 6 -4.153,8.08; 7 -1.384,8.08; 8 1.384,8.08; 9 4.153,8.08 | drill 3.048 pad 5.08: P$1 -12.446,9.501; P$2 12.446,9.501 | hole 3.048: -12.446,9.501; 12.446,9.501
PTC1812L = smd 1.7 x 3.15: 1 -2.62,0; 2 2.62,0
PIN02_1 = drill 1.016 square: 1 0,0 | drill 1.016: 2 2.54,0
SO08 = smd 0.6 x 2.2: 1 -1.905,-2.6; 2 -0.635,-2.6; 3 0.635,-2.6; 4 1.905,-2.6; 5 1.905,2.6; 6 0.635,2.6; 7 -0.635,2.6; 8 -1.905,2.6
SO16 = smd 0.66 x 2.032: 1 -4.445,-3.073; 2 -3.175,-3.073; 3 -1.905,-3.073; 4 -0.635,-3.073; 5 0.635,-3.073; 6 1.905,-3.073; 7 3.175,-3.073; 8 4.445,-3.073; 9 4.445,3.073; 10 3.175,3.073; 11 1.905,3.073; 12 0.635,3.073; 13 -0.635,3.073; 14 -1.905,3.073; 15 -3.175,3.073; 16 -4.445,3.073
TO220V = drill 1.016 pad 1.93: 1 -2.54,-2.54; 2 0,-2.54; 3 2.54,-2.54
PWP-TSSOP24 = smd 1.6 x 0.3: 1 -2.8,3.575; 2 -2.8,2.925; 3 -2.8,2.275; 4 -2.8,1.625; 5 -2.8,0.975; 6 -2.8,0.325; 7 -2.8,-0.325; 8 -2.8,-0.975; 9 -2.8,-1.625; 10 -2.8,-2.275; 11 -2.8,-2.925; 12 -2.8,-3.575; 13 2.8,-3.575; 14 2.8,-2.925; 15 2.8,-2.275; 16 2.8,-1.625; 17 2.8,-0.975; 18 2.8,-0.325; 19 2.8,0.325; 20 2.8,0.975; 21 2.8,1.625; 22 2.8,2.275; 23 2.8,2.925; 24 2.8,3.575
1X01_LONGPAD = drill 1.118 pad 1.88: 1 0,0
PIS2816 = smd 2.2 x 2.5: 1 0,3.2; 2 0,-3.2
DR127 = smd 3.85 x 5.5: 1 -4.975,0; 2 4.975,0
LED3MM = drill 0.813: A -1.27,0 | drill 0.813 square: K 1.27,0
6410-05 = drill 0.914 pad 1.524 square: 1 5.08,0 | drill 0.914 pad 1.524: 2 2.54,0; 3 0,0; 4 -2.54,0; 5 -5.08,0
MUSORH_CSATI = drill 0.914 pad 1.524 square: 1 -2.54,0 | drill 0.914 pad 1.524: 2 0,2.54; 3 0,0; 4 2.54,2.54; 5 2.54,0
MA10-2 = drill 0.914 pad 1.524 square: 1 -11.43,-1.27 | drill 0.914 pad 1.524: 2 -11.43,1.27; 3 -8.89,-1.27; 4 -8.89,1.27; 5 -6.35,-1.27; 6 -6.35,1.27; 7 -3.81,-1.27; 8 -3.81,1.27; 9 -1.27,-1.27; 10 -1.27,1.27; 11 1.27,-1.27; 12 1.27,1.27; 13 3.81,-1.27; 14 3.81,1.27; 15 6.35,-1.27; 16 6.35,1.27; 17 8.89,-1.27; 18 8.89,1.27; 19 11.43,-1.27; 20 11.43,1.27
CN_CANTAN = drill 0.914 octagon: 1 -5.08,-1.27; 3 -2.54,-1.27; 4 -2.54,1.27; 5 0,-1.27; 6 0,1.27; 7 2.54,-1.27; 8 2.54,1.27; 9 5.08,-1.27
SOT23 = smd 1 x 1.4: 1 -0.95,-1.1; 2 0.95,-1.1; 3 0,1.1
R0805 = smd 1.1 x 1.5: 1 -1.05,0; 2 1.05,0
R1210 = smd 1.6 x 2.7: 1 -1.4,0; 2 1.4,0
RJ45 = drill 0.9 pad 1.4 square: 1 -4.445,6.35 | drill 0.9 pad 1.4: 2 -3.175,8.89; 3 -1.905,6.35; 4 -0.635,8.89; 5 0.635,6.35; 6 1.905,8.89; 7 3.175,6.35; 8 4.445,8.89 | drill 2: S1 -7.77,-3.05; S2 7.77,-3.05 | hole 3.251: -5.715,0; 5.715,0
NSD-D = drill 1.168 pad 2.032: COMMON -10.16,0; CONTROL 10.16,-10.16; HACK -22.86,2.54; INPUT+ 10.16,2.54; INPUT- 10.16,-2.54; OUT+ -10.16,10.16; OUT- -10.16,-10.16; SZAB -5.08,-10.16
SOLDERJUMPER_CLOSEDWIRE = smd 1.168 x 1.6: 1 -0.762,0; 2 0.762,0 | smd 0.635 x 0.203: WIRE 0,0
SJ_2W_12 = smd 1.27 x 2.032: 1 -1.905,0; 2 0,0; 3 1.905,0
SJ_2W_23 = smd 1.27 x 2.032: 1 -1.905,0; 2 0,0; 3 1.905,0
6410-03 = drill 0.914 pad 1.524 square: 1 2.54,0 | drill 0.914 pad 1.524: 2 0,0; 3 -2.54,0

### Placement (x,y rotation side)
42V  23.34,38.73 270 top
C1  145.1,14.92 270 top
C2  108.27,25.08 90 top
C3  108.27,20 270 top
C4  136.21,14.92 90 top
C5  141.29,9.84 90 top
C6  133.67,9.84 270 top
C7  115.89,25.08 90 top
C8  128.59,9.84 90 top
C9  115.89,20 90 top
C10  128.59,14.92 90 top
C11  122.24,8.49 0 top
C12  110.81,14.92 270 top
C13  103.19,14.92 90 top
C14  115.89,9.84 90 top
C15  110.81,9.84 270 top
C16  128.59,20 90 top
C17  146.69,25.08 90 top
C18  128.59,30.16 90 top
C19  115.89,30.16 90 top
C20  133.67,30.16 90 top
C21  111.44,30.16 90 top
C22  21.27,38.42 90 bottom
C23  83.03,36.04 90 top
C24  85.09,36.04 90 top
C25  83.5,38.58 0 bottom
C26  123.51,20.64 180 bottom
C27  125.57,17.78 270 top
C47  22.23,29.85 90 top
C48  15.24,19.05 270 bottom
C49  12.38,19.05 270 top
C50  55.09,10.48 90 top
C51  53.02,10.8 90 bottom
C52  101.92,29.85 180 bottom
C53  102.71,34.29 0 top
C54  53.98,26.67 90 top
C55  51.75,26.67 90 bottom
C56  71.68,15 270 bottom
C57  54.61,18.41 90 top
C58  52.39,18.41 90 bottom
C59  73.66,10.8 180 bottom
C60  59.05,14.61 0 bottom
C61  58.74,19.68 0 bottom
C62  74.69,22.22 180 bottom
C63  65.72,13.02 180 top
C64  70.01,18.73 90 top
C65  68.26,9.68 180 top
C66  61.91,9.68 0 top
C67  74.69,19.76 180 bottom
C68  75.01,14.92 0 bottom
C69  75.01,17.14 0 bottom
C70  61.59,15.24 180 top
C71  44.93,17.14 90 bottom
D1  108.27,14.92 90 top
D2  106.05,14.92 270 top
D3  146.69,20 270 top
D4  119.22,11.03 270 bottom
D12  38.73,40.32 180 bottom
D13  38.73,37.15 180 bottom
D14  92.08,39.37 0 top
D15  38.42,17.14 90 bottom
D16  110.33,36.2 270 bottom
D17  107.79,36.2 90 bottom
D18  36.04,17.14 90 bottom
D19  40.8,17.14 90 bottom
DIGIT  111.76,3.81 180 top
DSUB1  42,42.83 180 top
F2  31.75,40.64 0 bottom
F_LED  141.6,26.35 270 top
FENYELL  131.44,26.35 270 top
HP_KI  53.66,3.17 0 top
IC1  122.24,12.38 90 top
IC2  122.24,22.54 90 top
IC3  95.57,20.95 90 top
IC4  122.24,28.89 90 top
IC9  82,42.83 0 top
IC11  65.72,17.14 0 bottom
IC12  142,42.83 0 top
JP1  80.64,37.15 0 top
JP2  86.84,40.32 0 top
L7  6.35,10.8 270 bottom
L8  6.35,19.68 270 bottom
L9  92.08,34.45 270 bottom
L10  76.36,11.27 270 top
L11  75.25,20 270 top
L12  62.55,20 270 top
LAMPA  66.99,3.17 0 top
LED1  137.48,20 90 top
MIC  151.76,15.88 90 top
MUSOR/NORMAL  93.98,12.38 180 top
POTI  139.7,3.81 0 top
PROG  10,31.18 0 top
Q1  128.27,25.08 180 top
Q3  86.84,28.89 0 bottom
R1  141.29,14.92 270 top
R2  105.73,25.08 270 top
R3  105.73,20 90 top
R4  138.75,14.92 90 top
R5  143.83,9.84 270 top
R6  110.81,25.08 270 top
R7  110.81,20 90 top
R8  136.21,9.84 90 top
R9  113.35,25.08 270 top
R10  133.67,14.92 270 top
R11  138.75,9.84 270 top
R12  131.13,9.84 270 top
R13  113.35,20 270 top
R14  131.13,14.92 270 top
R15  146.37,9.84 270 top
R16  103.19,9.84 90 top
R17  115.89,14.92 270 top
R18  100.65,9.84 90 top
R19  113.35,14.92 270 top
R20  105.73,9.84 90 top
R21  113.35,9.84 270 top
R22  131.13,20 90 top
R23  133.67,20 270 top
R24  108.27,9.84 90 top
R25  141.29,20 90 top
R26  143.83,20 270 top
R27  143.83,25.08 270 top
R28  103.19,20 270 top
R29  122.24,32.7 0 top
R30  103.19,25.08 270 top
R31  138.75,30.16 90 top
R32  131.13,30.16 270 top
R33  113.67,30.16 270 top
R34  136.21,30.16 270 top
R35  109.22,30.16 270 top
R36  7.46,35.08 270 bottom
R37  12.54,35.08 270 bottom
R38  116.92,11.83 90 bottom
R39  58.98,31.19 270 top
R47  17.78,19.05 90 bottom
R48  118.11,36.2 270 bottom
R49  115.57,36.2 270 bottom
R50  113.03,36.2 270 bottom
R51  47.62,17.14 270 bottom
R52  65.72,15.24 0 top
R53  67.79,18.73 270 top
R54  83.82,28.89 270 bottom
R55  33.81,17.14 270 bottom
R56  53.66,4.92 180 bottom
RJ2  65.5,34.58 180 top
SD2  25.4,12.7 180 top
SJ1  49.21,26.67 90 bottom
SJ2  58.42,17.3 0 bottom
SJ3  57.15,8.89 270 bottom
SJ4  88.27,16.19 0 top
SJ5  88.27,18.41 0 top
SJ6  52.7,14.61 0 bottom
SJ7  39.45,22.78 180 bottom
SJ8  69.85,15.24 180 top
SP_KI  60.01,3.17 0 top
T2  102,42.83 0 top
TAP  85.09,3.81 0 top
U$1  88.82,9.68 0 top

### Tracks (layer width: path | path; a pad name or v marks a point on that pad's centre or on a via)
1.
  Top 0.305: IC2.7 117.47,21.91 117.16,21.59 117.16,19.37 116.84,19.05 115.98,19.05 C9.1 R17.1
  Top 0.61: C9.1 R13.2
12V_TAP  (via drill 0.61)  (1 unrouted)
  Top 0.305: DIGIT.13 DIGIT.14 | v126.21,9.05 127,9.84 132.08,9.84 132.4,9.52 132.4,7.94 132.72,7.62 v149.22,7.62 | v151.76,7.62 153.03,7.62 154.31,8.89 154.31,33.66 151.76,36.2 138.43,36.2 136.53,38.1 120.65,38.1 118.75,36.2 116.62,36.2 R49.2
  Top 0.61: v85.09,34.93 82.97,34.93 | 82.97,34.93 78.74,34.93 77.47,36.2 77.47,38.3 IC9.1 77.36,42.39 39.21,42.39 33.34,36.51 33.34,29.85 40.64,21.91 v40.64,6.03 v42.31,6.03 | 82.97,34.93 C23.1 C24.1
  Bottom 0.305: DIGIT.13 104.14,4.45 104.78,3.81 120.33,3.81 120.65,4.13 120.65,6.03 123.67,9.05 v126.21,9.05 | v149.22,7.62 v151.76,7.62
  Bottom 0.61: SD2.OUT+ 35.56,3.81 37.78,6.03 v40.64,6.03 v42.31,6.03 47.82,6.03 51.53,9.75 | R51.2 47.62,13.65 51.53,9.75 | R49.2 R50.2 111.03,35.15 110.81,34.93 D16.A 110.33,35.4 109.86,35.88 106.36,35.88 104.78,37.47 96.52,37.47 93.5,34.45 89.06,34.45 88.58,34.93 v85.09,34.93 | 51.53,9.75 C51.1 54.04,9.75 C50.+ | SJ3.1 56.01,9.65 55.09,8.73
  other vias: 115.57,35.15
!MCLR
  Top 0.305: PROG.5 6.19,26.14 6.19,2.7 7.3,1.59 31.75,1.59 34.61,4.45 36.51,4.45 39.37,1.59 72.71,1.59 TAP.1
  Bottom 0.305: TAP.2 TAP.1
+5V
  Top 0.305: TAP.11 84.77,0.95 6.99,0.95 5.56,2.38 5.56,28.04 PROG.3 | TAP.12 TAP.14 90.17,3.81 92.08,3.81 92.71,4.45 92.71,6.35 90.17,8.89 90.17,13.34 92.49,15.66 IC3.16
  Top 0.61: IC9.3 87.36,37.47 97.76,37.47 C53.+
  Bottom 0.305: TAP.12 TAP.11 | TAP.14 TAP.13 | 98.9,29.79 99.06,29.95
  Bottom 0.61: L9.2 92.71,29.95 | 92.71,29.95 99.06,29.95 100.76,29.95 C52.1 100.87,34.22 C53.+ | TAP.12 83.03,8.41 83.03,18.26 | 83.03,18.26 85.41,20.64 87.95,20.64 89.22,21.91 89.22,27.3 89.53,27.62 91.76,27.62 92.08,27.94 92.08,29.32 92.71,29.95 | 83.03,18.26 83.03,19.84 83.26,20.08 83.26,27.15 83.86,27.74 | 83.86,27.74 83.98,27.86 | R54.2 83.82,27.78 83.86,27.74
  Bottom 1.016: C25.1 84.55,40.27 IC9.3
+12V  (via drill 0.61)  (2 unrouted)
  Top 0.305: v70.8,12.62 69.61,12.62 | 69.61,12.62 v68.58,12.62 | 72.07,9.52 71.83,9.52 69.61,11.75 69.61,12.62
  Top 0.61: C62.1 73.66,22.15 73.98,21.83 73.9,15.08 74.77,14.21 74.77,13.18 75.25,12.7 75.25,9.84 74.93,9.52 72.07,9.52 70.64,8.1 58.74,8.1 v58.42,8.33
  Bottom 0.305: v68.58,12.62 68.58,13.51 IC11.12 | IC11.10 69.9,14.87 70.48,14.29 70.48,12.94 v70.8,12.62 | IC11.3 73.16,19.42 73.5,19.76 C67.1 | IC11.1 68.52,20.1 68.5,20.08 68.5,19.45
  Bottom 0.61: C62.1 C67.1 | SJ3.2 58.21,8.13 v58.42,8.33
  other vias: 73.64,22.22
+24V
  Bottom 0.61: D13.1 D12.1 34.69,40.32 F2.1 34.37,38.5 33.97,38.1 26.67,38.1 24.77,40.01 42V.2
-24V
  Bottom 0.61: 23.5,38.42 24.77,38.42 26.35,36.83 34.29,36.83 36.38,34.75 DSUB1.9 38.73,35.63 38.73,41.59 39.37,42.23 63.82,42.23 65.41,40.64 65.41,32.7 62.33,29.62 RJ2.7 | 23.5,38.42 3.81,38.42 1.91,36.51 1.91,20 2.22,19.68 L8.1 | 42V.1 23.34,38.26 23.5,38.42
AGND  (via drill 0.61, 1.5)  (2 unrouted)
  Top 0.305: R31.1 138.75,26.35 | 138.75,26.35 FENYELL.1 130.18,27.62 127.64,27.62 127.32,27.31 Q1.2 126.95,26.13 122.24,26.13 | 138.75,26.35 F_LED.1 141.6,27.3 141.92,27.62 146.05,27.62 146.69,26.99 C17.2 152.3,26.13 153.67,24.77 153.67,20.32 MIC.2 MIC.3 MIC.4 149.32,10.89 R15.1 | R2.1 105.73,25.4 106.05,25.08 113.03,25.08 113.35,25.4 R9.1 | R28.1 103.19,20.32 103.5,20 104.14,20 104.46,19.68 104.46,19.37 104.78,19.05 105.63,19.05 R3.1 | R30.1 100.75,26.13 100.01,25.4 IC3.8 | R14.1 131.13,17.46 | 131.13,17.46 R22.1 | C7.2 116.74,26.13 117.63,25.24 121.28,25.24 122.18,26.13 122.24,26.13 | IC4.5 121.6,30.8 122.24,30.16 v122.24,29.21 122.24,26.13 | C1.- 145.1,10.89 | R28.1 103.19,21.91 104.46,23.18 104.46,25.97 104.62,26.13 | 131.13,17.46 142.24,17.46 142.56,17.78 142.56,19.68 142.88,20 144.78,20 145.1,20.32 145.1,21.91 144.78,22.22 139.7,22.22 138.75,23.18 138.75,26.35 | 133.35,3.81 130.18,3.81 129.54,4.45 129.54,6.03 128.27,7.3 122.56,7.3 122.24,7.62 122.24,9.68 | 122.24,9.68 122.24,10.32 123.19,11.27 123.19,16.19 123.98,16.99 v123.98,17.3 v123.98,19.05 | 127.38,15.97 C10.2 | R20.1 105.73,7.94 106.05,7.62 116.84,7.62 118.9,9.68 122.24,9.68 | POTI.5 133.35,3.81 | 133.35,3.81 POTI.6 | IC3.1 100.73,16.51 101.52,17.3 101.52,20.56 102.02,21.05 R28.1 | v75.27,19.76 74.77,19.27 74.77,15.32 75.56,14.53 75.56,13.49 76.04,13.02 76.04,9.92 v76.36,9.68
  Top 0.61: R30.1 104.62,26.13 R2.1 | R9.1 C7.2 | R16.1 R20.1 R24.1 | R5.1 145.1,10.89 R15.1 | C10.2 R14.1 | IC3.8 98.64,26.93 98.11,27.46 90.81,27.46 87.95,24.61 85.41,24.61 85.09,24.29 v84.93,24.37 | SJ8.2 69.09,16.8 68.9,16.99 68.9,17.68 | v51.83,8.25 v53.34,8.25 53.34,10.48 55.09,12.07 | R39.1 55.54,32.24 54.45,33.34
  Top 0.813: R52.1 C70.1 62.65,21.81 61.28,23.18 56.83,23.18 54.61,20.95 C57.- | R52.1 C63.2 | C64.1 68.9,17.68 R53.2 65.94,17.68 v65.64,17.38 64.67,16.41 R52.1
  Top 1.016: C27.1 126.58,18.83 127,18.26 v127.16,17.78
  Top 2.54: v74.53,29.21 77.23,29.21 80.17,32.15 v83.26,32.15 v81.84,32.15
  Bottom 0.305: IC11.24 IC11.23 64.39,20.07 64.77,19.68 64.77,17.62 v65.64,17.38 | IC11.13 IC11.14 64.39,14.22 64.77,14.61 64.77,15.83 64.43,16.17 | IC11.17 64.43,16.17 | v65.64,17.38 64.77,17.14 64.77,16.51 64.43,16.17 | v65.64,17.38 66.22,16.17 IC11.8 IC11.9 68.56,15.56 70.17,15.56 71.68,14.05 C56.2 | C26.2 124.56,19.46 v123.98,19.05 v123.98,17.3 | C62.2 75.74,20.24 v75.27,19.76 | 75.25,22.54 75.64,22.22 | R38.1 117.18,11.03 123.83,11.03 125.49,12.7 127.64,12.7 128.43,13.49 130.41,13.49 133.35,10.56 133.35,5
  Bottom 0.61: C54.+ 51.97,25.4 C55.1 | HP_KI.1 SP_KI.3 57.47,1.91 58.1,1.27 61.91,1.27 62.55,1.91 | 62.55,1.91 SP_KI.1 | 62.55,1.91 63.18,1.27 67.63,1.27 68.26,1.91 LAMPA.1 | RJ2.S2 53.26,37.62 DSUB1.1 47.54,30.57 48.26,29.85 54.61,29.85 55.88,28.57 55.88,27.3 C54.+ | 67.07,23.02 54.77,23.02 | R56.2 54.93,4.7 HP_KI.1 | v76.36,9.68 76.28,9.6 75.56,9.6 75.5,9.62 75.47,9.62 74.77,10.32 74.77,10.73 C59.2 | C57.- 54.39,19.46 C58.2 52.39,19.45 | 54.77,23.02 54.61,22.86 C57.- | C54.+ 53.98,23.81 54.77,23.02 | C50.- 54.68,11.84 C51.2 53.47,12.29 SJ6.1 54.45,14.61 56.67,16.83 SJ2.3 56.36,17.94 54.59,19.68 C57.- | v53.34,8.25 v51.83,8.25 50.88,7.3 50.8,2.78 51.75,1.83 53.58,1.83 HP_KI.1 | 75.17,22.78 75.17,29.13 75.25,29.21 v75.96,29.21 v74.53,29.21 | 75.17,22.78 75.17,22.62 75.25,22.54 75.49,22.3 75.17,22.78 | 84.93,24.77 84.93,26.27 85.88,27.23 85.88,27.63 Q3.2 | v84.93,24.37 84.85,24.45 84.85,24.69 | 84.85,24.69 84.85,24.77 84.93,24.77 | 84.93,24.77 84.85,24.69 | C67.2 75.25,19.76
  Bottom 1.27: 38.42,13.65 42.7,13.73 43.02,14.05 42.94,19.84 | 38.42,13.65 36.04,13.65 | D18.C 36.04,13.65 | 36.04,13.65 35.56,13.18 SD2.COMMON | 42.94,19.84 41.35,21.43 SJ7.3 | D15.C 38.42,13.65 | 42.94,19.84 45.24,19.84 45.96,20.56 52.39,20.56 C58.2
  other vias: 117.79,26.04 112.08,22.54 135.25,25.4 150.5,24.13 138.11,23.18 147.96,13.34 142.56,17.46
  pour Top: 158.75,48.26 73.58,48.34 73.42,-5.4 158.59,-5.48
  pour Bottom: 50.32,45.4 158.12,45.09 158.12,-1.75 50.32,-0.95
CANH
  Top 0.305: TAP.9 82.55,3.81 80.64,3.81 80.01,4.45 80.01,5.72 78.74,6.99 72.87,6.99 71.6,5.72 46.99,5.72 41.88,10.83 41.88,26.79 46.2,31.11 46.2,32.7 45.56,33.34 44.79,33.34 DSUB1.7
  Bottom 0.305: RJ2.5 63.63,26.99 62.87,26.99 62.23,26.35 62.23,25.08 61.59,24.45 60.33,24.45 59.37,25.4 59.37,29.21 63.5,33.34 63.5,39.53 62.55,40.48 44.13,40.48 43.38,39.73 DSUB1.7 43.38,30.05 42.55,29.21 27.94,29.21 23.5,33.66 19.68,33.66 15.88,37.47 6.35,37.47 5.71,36.83 5.71,33.58 6.19,33.1 6.19,31.51 6.51,31.19 8.71,31.19 PROG.6 | TAP.10 TAP.9
CANL
  Top 0.305: TAP.8 81.28,5.87 79.53,7.62 72.55,7.62 71.28,6.35 47.7,6.35 42.58,11.47 42.58,24.48 49.05,30.96 49.05,33.66 47.96,34.75 DSUB1.6
  Bottom 0.305: RJ2.4 64.26,23.81 60.01,23.81 58.74,25.08 58.74,29.53 62.87,33.66 62.87,39.21 62.23,39.85 47.31,39.85 46.15,38.69 DSUB1.6 46.2,34.7 46.2,31.11 43.66,28.57 27.62,28.57 23.18,33.02 19.37,33.02 16.25,36.13 R37.1 R36.1 | TAP.8 TAP.7
CLK
  Top 0.305: PROG.9 7.46,22.33 7.46,3.33 7.94,2.86 31.11,2.86 33.97,5.72 37.15,5.72 40.01,2.86 47.62,2.86 49.85,5.08 71.91,5.08 73.18,6.35 77.47,6.35 TAP.6
  Bottom 0.305: TAP.6 TAP.5
CRM  (via drill 0.61)
  Top 0.305: IC3.9 v95.09,25.4 | DIGIT.4 DIGIT.3
  Bottom 0.305: DIGIT.4 114.62,0.32 88.42,0.32 87.63,1.11 87.63,6.03 83.82,9.84 83.82,17.78 85.72,19.68 88.27,19.68 90.17,21.59 90.17,24.45 91.12,25.4 v95.09,25.4
CROSSMUTE_CS
  Top 0.305: POTI.13 141.92,0.95 101.12,0.95 99.38,2.7 99.38,14.21 98.42,15.16 97,15.16 96.84,15.32 96.84,18.81 97.08,19.05 IC3.3
CROSSMUTE_MAX
  Top 0.305: MUSOR/NORMAL.4 93.03,8.25 98.74,8.25 | 98.74,8.25 98.74,13.65 97.95,14.45 96.52,14.45 96.2,14.76 96.2,21.27 96.52,21.59 IC3.5 | 98.74,8.25 98.74,2.38 100.81,0.32 143.19,0.32 144.78,1.91 144.78,3.81 POTI.14
CSIP  (via drill 0.61)
  Top 0.305: DIGIT.2 DIGIT.1
  Top 0.61: D2.C D1.A
  Bottom 0.305: D1.A 108.27,10.48 111.12,7.62 116.84,7.62 DIGIT.1
  other vias: 108.27,16.62
DAT
  Top 0.305: PROG.7 6.83,24.16 6.83,3.02 7.62,2.22 31.43,2.22 34.29,5.08 36.83,5.08 39.69,2.22 47.94,2.22 50.16,4.45 72.39,4.45 73.03,3.81 74.93,3.81 TAP.3
  Bottom 0.305: TAP.4 TAP.3
DIN_MIC
  Top 0.305: R5.2 144.68,8.79 145.1,9.21 145.1,9.52 145.41,9.84 150.81,9.84 MIC.5
  Top 0.61: R5.2 C5.1
EL_MIC
  Top 0.305: MIC.1 150.5,20.95 149.86,20.32 149.86,15.88 148.91,14.92 140.34,14.92 140.02,14.61 140.02,14.29 139.7,13.97 138.84,13.97 R4.1
  Top 0.61: R4.1 C4.1
GAIN_CS
  Top 0.305: R12.2 131.13,7.46 131.6,6.99 147.8,6.99 148.59,6.19 POTI.18 POTI.17
GAIN_MAX
  Top 0.305: POTI.16 POTI.15 146.05,0.95 146.69,0.32 151.76,0.32 152.4,0.95 152.4,6.03 151.92,6.51 150.81,6.51 150.5,6.83 150.5,8.25 149.96,8.79 R15.2
GAIN_MIN
  Top 0.305: 128.59,7.94 130.18,6.35 146.69,6.35 147.32,5.72 147.32,1.75 148.11,0.95 149.54,0.95 POTI.19 POTI.20 | IC1.1 123.51,10.48 123.29,10.26 C11.2 124.22,8.49 124.78,7.94 128.59,7.94 | C8.1 128.59,7.94
GND  (via drill 0.61)  (1 unrouted)
  Top 0.305: TAP.15 89.22,0.32 6.67,0.32 4.92,2.07 PROG.1 | TAP.20 TAP.19
  Top 0.61: v82.39,6.83 89.69,6.83 TAP.16 | C24.2 C23.2 83.03,39.26 IC9.2 83.94,42.23 86.04,42.23 86.84,41.43 | JP2.1 86.84,41.43 | 86.84,41.43 87.63,42.23 93.34,42.23 94.06,41.52 D14.2 97.79,39.37 100.33,36.83 104.49,36.83 | 104.49,36.83 C53.- | R48.1 104.9,37.25 104.49,36.83
  Top 1.016: v65.64,30.16 v64.53,30.16 58.74,30.16 58.42,29.85 52.07,29.85 49.77,27.54 49.77,16.78 SJ6.2
  Bottom 0.305: TAP.16 TAP.15
  Bottom 0.61: v82.39,6.83 82.07,7.14 82.07,20.16 82.23,20.48 82.23,28.26 76.2,34.29 | 78.9,38.1 80.8,39.05 80.96,39.25 IC9.2 | TAP.16 TAP.18 | TAP.18 TAP.20 | TAP.17 TAP.18 | C52.2 102.97,32.77 C53.-
  Bottom 1.016: 78.9,38.1 78.58,36.67 76.2,34.29 72.07,30.16 v65.64,30.16 | 65.41,30.16 v64.53,30.16 | C25.2 82.45,39.83 IC9.2
  other vias: 118.11,37.25 51.94,14.61
HALACSKA4
  Bottom 0.305: 23.26,14.81 23.26,11.32 25.8,14.81 27.71,14.81 28.66,14.18 28.98,13.54 30.88,12.91 27.07,12.91 28.98,12.27 28.34,11.64 27.39,11 25.8,11 23.26,14.81
HALACSKA7
  Top 0.305: 29.92,16.08 29.92,12.59 27.38,16.08 25.47,16.08 24.52,15.45 24.2,14.81 21.03,14.18 26.11,14.18 24.2,13.54 24.84,12.91 25.79,12.27 27.38,12.27 29.92,16.08
HP
  Top 0.305: IC3.13 94.3,20.32 94.93,19.68 94.93,13.97 MUSOR/NORMAL.1 | POTI.11 POTI.12
  Bottom 0.305: MUSOR/NORMAL.1 103.5,12.38 105.73,14.61 105.73,17.94 107.79,20 116.52,20 121.92,14.61 | 122,14.61 126.68,14.61 127.48,15.4 134.62,15.4 136.37,13.65 136.37,9.68 POTI.12 | 121.92,14.61 122,14.61 | 122,14.61 122,14.68 121.92,14.61
HPIN_X  (via drill 0.61)
  Top 0.305: SJ5.1 83.5,18.41 81.12,16.03 v80.01,16.03
  Bottom 0.305: C69.1 75.74,17.21 76.91,16.03 v80.01,16.03
HPOUT  (via drill 0.61)
  Top 0.61: L12.2 59.03,19.68 C61.2
  Bottom 0.305: IC11.22 61.86,19.42 60.96,20.32 60.96,20.64 60.64,20.95 58.02,20.95 57.61,20.54 57.61,19.68 C61.2
  other vias: 57.69,19.68
IN+  (via drill 0.61)
  Top 0.305: v107.47,29.53 106.84,28.89 99.85,28.89 99.22,29.53 89.69,29.53 86.84,26.67 70.48,26.67 69.5,25.68 RJ2.2 68.67,32.29 60.01,40.96 40.32,40.96 35.08,35.72 35.08,30.96 35.72,30.32 39.85,30.32 40.64,31.11 40.64,32.86 41.12,33.34 43.33,33.34 DSUB1.2
  Top 0.61: C2.1 R2.2
  Bottom 0.305: v107.47,29.53 105.73,27.78 R2.2
  other vias: 105.73,24.03
IN-  (via drill 0.61)
  Top 0.305: v107.31,30.96 105.89,29.53 100.17,29.53 99.54,30.16 89.38,30.16 86.52,27.3 71.91,27.3 70.99,28.22 RJ2.1 69.94,31.97 60.33,41.59 40.01,41.59 34.29,35.88 34.29,30.48 35.24,29.53 40.96,29.53 42,30.57 DSUB1.3
  Top 0.61: R3.2 C3.1
  Bottom 0.305: v107.31,30.96 105.09,28.73 105.09,25.56 104.62,25.08 104.62,22.16 R3.2
  other vias: 105.73,21.05
LAMPA_CS
  Bottom 0.305: POTI.2 129.54,3.81 129.54,1.91 130.49,0.95 153.35,0.95 153.99,1.59 153.99,32.07 149.86,36.2 112.08,36.2 111.76,36.51 111.76,39.05 111.44,39.37 106.05,39.37 105.41,38.73 101.01,38.73 T2.1
LAMPA_MAX
  Bottom 0.305: D17.C 107.79,33.5 107.95,33.34 111.92,33.34 112.55,33.97 117.79,33.97 118.11,34.29 R48.2 149.64,35.15 153.35,31.43 153.35,4.45 152.72,3.81 132.08,3.81 POTI.3
LAMPA_MIN
  Bottom 0.305: POTI.1 128.27,1.27 129.22,0.32 153.67,0.32 154.62,1.27 154.62,32.7 149.86,37.47 120.33,37.47 119.06,38.73 116.2,38.73 115.57,38.1 R49.1
MH  (via drill 0.61)
  Top 0.305: IC3.11 94.77,22.86 v95.41,22.22 | DIGIT.8 DIGIT.7
  Bottom 0.305: DIGIT.7 109.06,7.78 88.74,7.78 85.72,10.8 85.72,16.83 86.68,17.78 89.22,17.78 93.19,21.75 94.93,21.75 v95.41,22.22
MIC_MUTE  (via drill 0.61)
  Top 0.305: DIGIT.12 DIGIT.11 106.68,6.03 107,6.35 118.43,6.35 v119.54,7.46
  Bottom 0.305: v119.54,7.46 119.54,9.05 119.22,9.37 | 119.14,9.45 119.22,9.37 | 119.22,9.37 D4.A
MUTE  (via drill 0.61)
  Top 0.305: DIGIT.9 DIGIT.10 | v96.2,24.45 96.2,26.35 95.89,26.67 91.76,26.67 90.81,25.72 90.81,22.86 89.85,21.91 v87.23,21.91
  Bottom 0.305: DIGIT.9 107.16,7.14 88.42,7.14 85.09,10.48 85.09,17.14 86.36,18.41 88.9,18.41 93.5,23.02 94.77,23.02 v96.2,24.45 | Q3.1 87.31,27.7 87.31,21.99 v87.23,21.91
N$1
  Top 0.61: R4.2 R1.1 144.88,15.97 C1.+
N$2
  Top 0.61: C4.2 R10.1
N$3
  Top 0.61: R8.2 R11.1 C5.2
N$4
  Top 0.305: IC1.3 127,13.02 127.64,13.65 128.37,13.65 C10.1
  Top 0.61: R10.2 R14.2 C10.1
N$5
  Top 0.305: IC1.2 126.68,11.75 127.32,11.11 128.37,11.11 C8.2 | C6.1 134.52,10.89 134.94,10.48 134.94,10.16 135.25,9.84 137.16,9.84 137.48,9.52 137.48,9.21 137.79,8.89 138.65,8.89 R11.2
  Top 0.61: C8.2 R12.1 C6.1
N$6  (2 unrouted)
  Bottom 0.61: C54.- 51.97,27.94 C55.2 51.51,27.48 48.52,27.48 | 37.78,21.11 37.78,19.08 D15.A 38.42,18.81 | D19.A 40.77,18.81 38.42,18.81 | 38.42,18.81 38.26,18.81 | 37.78,21.11 37.78,22.46 SJ7.1 | 37.78,21.11 34.77,21.11 33.89,21.99 33.89,23.65 36.51,26.27 47.15,26.27 48.34,27.46 49.21,27.46 49.29,27.54
N$7
  Bottom 0.61: RJ2.8 60.33,26.41 60.33,29.05 64.45,33.18 64.45,39.85 63.02,41.28 42.55,41.28 41.59,40.32 D12.2
N$8
  Top 0.61: C6.2 R8.1
N$9
  Top 0.305: FENYELL.2 131.28,23.98 Q1.3 127.47,23.98 126.05,25.4 122.87,25.4 121.28,23.81 121.28,14.61 120.97,14.29 IC1.5 118.59,14.29 116.28,11.99 100.65,11.99 R18.2
N$10  (via drill 0.61)
  other vias: 77.87,17.22
N$11  (via drill 0.61)
  other vias: 78.58,23.89
N$12
  Top 0.305: IC3.4 100.01,20.32 100.49,19.84 100.49,18.18 100.09,17.78 IC3.2
N$13
  Top 0.305: R16.2 103.19,10.16 102.87,9.84 100.97,9.84 100.65,9.52 R18.1 100.65,7.3 100.97,6.99 117.16,6.99 118.67,8.49 C11.1
N$14
  Top 0.305: IC4.2 126.05,28.26 127.32,29.53 127.32,29.85 127.64,30.16 128.27,30.16 128.59,30.48 C18.2 128.49,31.11 | R32.1 131.13,30.48 131.44,30.16 138.43,30.16 138.75,30.48 R31.2
  Top 0.61: C18.2 R32.1
N$15
  Top 0.305: IC4.1 125.73,26.99 127,28.26 128.59,28.26 C18.1
  Top 0.61: C18.1 R32.2 C20.1
N$16
  Top 0.305: IC1.6 118.43,13.02 117.16,11.75 117.16,11.43 116.84,11.11 116.11,11.11 C14.2 | R21.1 113.25,10.54 113.43,10.87 113.43,10.48 112.79,9.84 106.28,9.84 105.73,10.4 R20.2
  Top 0.61: C14.2 R21.1
N$17
  Top 0.305: C14.1 115.98,8.89 116.84,8.89 117.79,9.84 117.79,11.43 118.11,11.75 IC1.7 121.28,11.75 121.92,12.38 121.92,22.54 122.56,23.18 IC2.3
  Top 0.61: C15.2 R21.2 C14.1
N$18
  Top 0.305: IC2.2 127,21.91 127.64,21.27 128.37,21.27 C16.2
  Top 0.61: C16.2 R22.2 R23.1
N$19
  Top 0.305: IC4.6 118.43,29.53 116.84,31.11 | 116.84,31.11 115.98,31.11 C19.2 | R29.1 120.49,32.7 119.86,32.07 117.79,32.07 116.84,31.11
  Top 0.61: R33.1 C19.2
N$20
  Top 0.305: R23.2 137.26,18.95 LED1.A 137.7,18.95 R25.1
N$21
  Top 0.305: IC2.1 126.21,20.64 127.79,19.05 128.49,19.05 C16.1 129.44,18.95 129.86,19.37 129.86,19.68 130.18,20 136.21,20 LED1.K 137.7,21.05 R25.2
  Top 0.61: R25.2 R26.1
N$22
  Top 0.305: R26.2 145.72,18.95 D3.A
N$23
  Top 0.305: D3.C C17.1
  Top 0.61: C17.1 R27.2
N$24
  Top 0.305: F_LED.2 141.6,24.77 141.92,25.08 143.51,25.08 143.83,25.4 R27.1
N$25  (via drill 0.61)
  Top 0.305: IC4.3 126.36,29.53 126.68,29.85 126.68,32.7 | 126.68,32.7 v140.97,32.7 | v137.48,12.3 v129.86,12.3 | R29.2 126.68,32.7
  Top 0.61: R24.2 C15.1
  Bottom 0.305: v140.97,32.7 140.97,29.85 139.7,28.57 139.7,17.14 143.51,13.34 143.51,12.07 142.24,10.8 138.99,10.8 v137.48,12.3 | v129.86,12.3 129.62,12.07 125.73,12.07 120.02,6.35 119.06,6.35 114.52,10.89 C15.1
  other vias: 110.81,10.89
N$26
  Top 0.305: IC4.7 117.79,28.26 117.16,28.89 116.11,28.89 C19.1
  Top 0.61: C21.1 R33.2 C19.1
N$27
  Top 0.61: R35.1 C21.2
N$28
  Top 0.61: C20.2 R34.1
N$29
  Top 0.61: R6.1 C2.2
N$30  (via drill 0.61)
  Top 0.305: v120.33,19.37 117.47,16.51 v117.47,15 | Q1.1 129.94,25.47 v129.94,25
  Bottom 0.305: v129.94,25 128.11,23.18 128.11,22.07 124.94,18.89 124.94,16.91 124.38,16.35 122.63,16.35 120.33,18.65 v120.33,19.37 | D4.C 117.06,12.73 R38.2 117.46,12.88 117.47,12.86 v117.47,15
N$31
  Top 0.305: IC2.5 117.47,24.45 117.16,24.13 115.98,24.13 C7.1
  Top 0.61: C7.1 R9.2 R6.2
N$32
  Top 0.61: R7.1 C3.2
N$33
  Top 0.254: 148.67,41.67 154.23,41.67 154.23,38.97 148.67,38.97 148.67,41.67
N$34
  Bottom 0.61: C65.- 66.99,6.19 65.41,4.6 61.44,4.6 SP_KI.2
N$35
  Top 0.305: C12.2 109.92,13.87 109.27,13.22 D1.C
  Top 0.61: D1.C D2.A
N$36
  Top 0.305: IC2.6 117.47,23.18 115.89,21.59 C9.2
  Top 0.61: R7.2 R13.1 C9.2
N$37
  Bottom 0.254: 8.1,4.52 2.54,4.52 2.54,1.83 8.1,1.83 8.1,4.52
N$39
  Top 0.305: C13.1 103.19,14.61 103.5,14.92 104.14,14.92 104.46,15.24 104.46,17.46 104.78,17.78 114.3,17.78 114.62,17.46 114.62,13.87
  Top 0.61: R17.2 114.62,13.87 R19.2
N$40
  Top 0.61: R19.1 C12.1
N$46
  Bottom 0.61: 39.61,22.07 SJ7.2 39.45,24.21 38.73,24.92 36.67,24.92 35.56,23.81 SD2.OUT-
N$49  (via drill 0.61)
  Top 0.305: IC3.14 93.98,19.05 94.3,18.73 94.3,14.61 92.71,13.02 92.71,11.11 MUSOR/NORMAL.2
  Top 0.61: IC3.14 90.81,19.05 90.17,18.41 SJ5.2
  Bottom 0.305: MUSOR/NORMAL.2 92.71,11.11 89.06,11.11 87.95,12.22 87.95,13.81 88.11,13.97 90.01,13.97 91.28,15.24 102.23,15.24 102.55,14.92 104.14,14.92 104.46,15.24 104.46,20 103.19,21.27 R30.2
  other vias: 103.19,24.03
N$50  (via drill 0.61)
  Top 0.61: IC3.15 91.12,17.78 90.81,17.46 90.81,16.83 90.17,16.19 SJ4.2 89.03,15.75 v89.06,15.72
  Bottom 0.61: v89.06,15.72 89.69,15.72 92.93,18.95 R28.2
  other vias: 103.19,18.95
N$51
  Bottom 0.305: R37.2 12.54,31.7 PROG.8
N$52  (via drill 0.61)
  Bottom 1.524: v92.08,36.04 92.08,39.21
N$53  (via drill 0.61)
  other vias: 92.08,31.43
N$54
  Bottom 1.524: 92.08,31.27 92.08,31.43
N$55
  Bottom 0.61: 44.93,10.16 35.56,10.16 33.81,11.91 R55.2 | 44.93,10.16 SD2.HACK | C71.1 44.93,10.16
N$57
  Bottom 0.305: R36.2 7.46,32.25 PROG.4
N$59  (via drill 0.61)
  Top 0.254: IC3.6 99.77,22.86 99.93,22.7 v100.49,22.7
  Bottom 0.254: v100.49,22.7 99.22,22.7 98.42,23.5 98.42,24.92 101.92,28.42 101.92,33.02 102.71,33.81 102.71,35.56 102.23,36.04 96.36,36.04 93.98,33.66 88.9,33.66 86.84,31.59 Q3.3
  Bottom 0.305: R54.1 83.88,29.94 83.98,29.85 84.13,29.99 Q3.3 86.36,29.92
N$71
  Bottom 0.61: DSUB1.8 40.62,37.05 D13.2
N$72
  Bottom 0.61: F2.2 26.04,40.64 24.77,41.91 3.81,41.91 0.64,38.73 0.64,11.43 1.27,10.8 L7.1
N$74
  Top 0.61: C22.+ 20.32,35.69 20.32,29.97 C47.+
  Bottom 0.61: L7.2 11.43,10.8 12.06,10.16 SD2.INPUT+ 22.23,17.14 C47.+
N$75
  Bottom 0.305: C49.+ 15.02,20.32 C48.1
  Bottom 0.61: R47.2 C48.1 SD2.CONTROL
N$76
  Top 0.61: C47.- 25.4,34.8 25.4,41.28 24.77,41.91 22.99,41.91 C22.-
  Bottom 0.305: 12.48,18 12.48,17.88 C49.-
  Bottom 0.61: C48.2 R47.1 19.27,18 19.37,18.1 19.37,31.11 19.88,31.62 C47.- | SD2.INPUT- C48.2 | L8.2 10.79,19.68 12.48,18 C48.2
N$77  (via drill 0.61)
  Top 0.61: D14.1 91.55,39.37 L9.1
  Bottom 0.61: JP1.1 86.2,37.15 88.9,39.85 92.02,39.85 L9.1
  other vias: 92.08,39.42
N$78
  Bottom 0.61: R50.1 113.03,39.37 112.11,40.29 T2.3
N$80
  Bottom 0.61: D16.C D17.A
N$81  (via drill 0.61)
  Top 0.61: v76.2,31.75 v76.2,40.64
  Bottom 0.61: v76.2,31.75 81.12,26.83 81.12,8.1 79.53,6.51 69.06,6.51 LAMPA.2 | v76.2,40.64 76.2,41.28 77.15,42.23 101.6,42.23 102,41.83 T2.2
N$82  (1 unrouted)
  Bottom 0.305: IC11.7 70.89,16.82 71.68,16.03
N$83  (1 unrouted)
  Bottom 0.305: IC11.11 69.6,14.22 69.85,13.97 69.85,12.22 70.41,11.67 71.36,11.67 72.15,10.87 72.55,10.87
N$84
  Bottom 0.305: IC11.21 61.56,18.77 60.64,19.68 C61.1
N$85
  Bottom 0.305: IC11.16 61.72,15.52 60.8,14.61 C60.1
N$86
  Top 0.61: R52.2 66.77,14.05 | 66.77,14.05 C63.1 66.77,11.97 67.47,11.27 67.94,11.27 C65.+ | L10.2 73.16,12.09 71.52,13.73 68.02,13.73 67.71,14.05 66.77,14.05
N$87
  Top 0.61: L12.1 67.79,20 | 67.79,20 R53.1 | L11.2 70.01,20 | C64.2 70.01,20 | 70.01,20 67.79,20
N$89
  Bottom 0.61: HP_KI.2 52.39,4.7 R56.1 52.61,6.09 52.86,6.35 60.64,6.35 63.18,8.89 C66.-
N$90
  Bottom 0.305: IC11.6 72.22,17.47 72.93,16.77 72.95,15.48 73.5,14.92 C68.2
N$91
  Bottom 0.305: IC11.5 72.37,18.12 73.34,17.14 C69.2
N$92
  Bottom 0.305: IC11.18 61.98,16.82 61.67,16.51 61.67,16.27 61.28,15.88 59.21,15.88 58.42,16.67 SJ2.2
N$93  (via drill 0.61)
  Top 0.305: v73.5,13.34 71.83,15.24 SJ8.1
  Bottom 0.305: IC11.4 72.67,18.77 73.03,18.41 74.69,18.41 75.01,18.1 75.01,13.81 74.69,13.49 73.66,13.49 v73.5,13.34
N$94
  Bottom 0.61: D19.C 40.8,16.35 39.93,17.22 36.91,17.22 36.04,18.1 36.04,18.73 | 36.04,18.97 D18.A 36.04,18.73 | R55.1 34.35,18.73 36.04,18.73
N$95  (1 unrouted)
  Top 0.61: 59.37,15.24 C70.2 | C66.+ 59.05,11.11 59.05,14.92 59.37,15.24 | 59.37,15.24 54.37,15.24 51.04,18.57 51.12,20.48 57.71,27.07 61.67,26.99 62.33,26.33 62.33,25.06 64.45,22.94 69.85,22.94 71.44,24.53 74.93,24.53 78.42,21.03 78.42,20
OUT+  (via drill 0.61)
  Top 0.305: v116.52,27.62 99.22,27.62 98.58,28.26 90.33,28.26 87.47,25.4 71.12,25.4 69.53,23.81 67.63,23.81 67.31,24.13 64.77,24.13 63.59,25.3 RJ2.6 64.9,26.99 65.56,26.99 66.2,27.62 66.2,28.73 66.67,29.21 66.67,32.39 59.37,39.69 40.96,39.69 39.23,37.96 DSUB1.4 | v133.67,27.62 135.57,27.62 136.21,28.26 R34.2
  Bottom 0.305: v116.52,27.62 v133.67,27.62
OUT-
  Top 0.305: R35.2 109.22,29.05 108.74,28.89 108.43,28.89 107.79,28.26 99.54,28.26 98.9,28.89 90.01,28.89 87.15,26.04 70.8,26.04 69.22,24.45 67.94,24.45 67.41,24.99 RJ2.3 67.41,32.61 59.69,40.32 40.64,40.32 36.46,36.15 DSUB1.5
POTI_JEL  (via drill 0.61)
  Top 0.305: POTI.7 POTI.8
  Bottom 0.305: C13.2 91.06,15.97 89.69,14.61 87.63,14.61 87.31,14.29 87.31,11.91 88.9,10.32 89.85,10.32 90.17,10 90.17,9.21 90.81,8.57 97.79,8.57 98.74,9.52 102.55,9.52 107,13.97 107,17.3 108.43,18.73 115.89,18.73 121.28,13.34 127.32,13.34 128.11,14.13 133.99,14.13 134.78,13.34 135.1,13.02 135.1,5.87 POTI.8
  other vias: 103.19,15.97
SP
  Top 0.305: POTI.9 POTI.10
  Bottom 0.305: MUSOR/NORMAL.5 92.71,13.65 94.61,13.65 95.25,13.02 95.25,11.43 95.57,11.11 103.19,11.11 106.36,14.29 106.36,17.62 108.11,19.37 116.2,19.37 121.6,13.97 127,13.97 127.79,14.76 134.3,14.76 135.02,14.05 135.1,13.97 135.73,13.34 135.73,7.78 POTI.10
SPIN_X  (via drill 0.61)  (1 unrouted)
  Top 0.305: SJ4.1 82.87,16.19 81.12,14.45 v80.01,14.45
  Bottom 0.305: C68.1 76.04,14.53 | v80.01,14.45 76.12,14.45 75.8,14.76
SPM  (via drill 0.61)
  Top 0.305: IC3.10 v94.46,24.13 | DIGIT.6 DIGIT.5
  Bottom 0.305: DIGIT.6 112.71,0.95 90.81,0.95 90.17,1.59 90.17,5.72 89.38,6.51 88.11,6.51 84.45,10.16 84.45,17.46 86.04,19.05 88.58,19.05 90.81,21.27 90.81,23.18 91.76,24.13 v94.46,24.13
SPOUT  (via drill 0.61)
  Top 0.305: v79.53,9.68 L10.1
  Bottom 0.305: IC11.15 61.94,14.87 61.44,14.37 61.44,13.81 61.04,13.41 57.94,13.41 | v79.53,9.68 79.53,9.52 77.31,7.94 69.06,7.94 68.26,8.73 68.26,10.24 67.55,10.95 62.63,10.95 61.91,10.24 61.91,9.21 61.04,8.33 59.85,8.33 59.05,9.13 59.05,9.92 58.18,10.8 57.94,10.8 | 57.94,10.8 52.07,10.8 49.53,13.34 49.53,16.83 49.21,17.14 46.04,17.14 44.99,18.2 C71.2 | C60.2 57.94,14.46 57.94,13.41 | 57.94,13.41 57.94,10.8
VDD  (via drill 0.61)  (1 unrouted)
  Top 0.305: v118.27,20.64 IC2.8 | IC1.8 121.13,10.48 122.56,11.91 122.56,17.7 v122.95,18.18 | IC4.8 119.64,26.41 v119.7,26.35 | R1.2 v141.29,13.02
  Top 0.61: SJ2.1 61.59,18.56 61.59,21.27 60.8,22.07 57.63,22.07 56.52,20.95 56.52,19.05 C57.+ 52.63,19.13 | v89.06,12.86 88.74,12.54 82.39,12.54 81.68,13.26 76.91,13.26 76.36,13.81 76.36,16.03 75.56,16.83 75.56,17.94 76.36,18.73 76.36,21.51 74.37,23.5 72.07,23.5 70.33,21.75 64.29,21.75 61.75,24.29 56.28,24.29 52.7,20.72 52.7,19.29 52.63,19.21
  Bottom 0.305: IC11.19 IC11.20 61.94,18.12 61.12,17.3 SJ2.1 | v89.06,12.86 89.85,12.86 91.6,14.61 101.92,14.61 102.23,14.29 104.46,14.29 105.09,14.92 105.09,18.26 107.47,20.64 v118.27,20.64 | v118.27,20.64 C26.1 122.46,19.46 122.95,18.89 v122.95,18.18 | v119.7,26.35 119.7,22.07 v118.27,20.64 | v141.29,13.02 139.06,15.24 139.14,15.16 138.27,16.03 127.16,16.03 126.36,15.24 122.71,15.24 118.27,19.68 v118.27,20.64
  Bottom 0.61: R51.1 49.72,18.54 50.9,17.36 C58.1 54.39,17.36 C57.+
  other vias: 60.33,17.3
VSS  (via drill 0.61)  (1 unrouted)
  Top 0.305: IC1.4 124.84,15.54 v125.97,16.35 C27.2 | v129.7,22.7 127.48,22.7 125.73,24.45 IC2.4 | IC4.4 122.87,30.8 122.24,31.43 122.24,33.66 122.56,33.97 v125.41,33.97
  Top 0.61: v88.9,9.21 88.27,8.57 72.39,8.57 70.96,7.14 51.36,7.14 50.56,7.78 50.56,14.05 48.26,16.35 v48.26,23.73 | v100.49,24.13 IC3.7
  Bottom 0.305: v125.41,33.97 132.4,33.97 137.32,29.05 137.32,24.77 134.62,22.07 130.33,22.07 v129.7,22.7 125.97,18.97 v125.97,16.35
  Bottom 0.61: v88.9,9.21 88.58,9.21 86.52,11.27 86.52,16.35 87.15,16.99 89.53,16.99 93.5,20.95 100.65,20.95 101.76,22.07 101.76,23.81 101.44,24.13 v100.49,24.13 104.3,27.94 104.3,29.85 106.84,32.39 123.83,32.39 v125.41,33.97 | v48.26,23.73 49.21,24.69 49.21,25.96
X0
  Top 0.305: IC3.12 94.3,21.59 95.57,20.32 95.57,14.37 96.2,13.73 97.39,13.73 98.11,13.02 98.11,11.43 97.79,11.11 95.25,11.11 MUSOR/NORMAL.3
(copper drawn outside any net)
  shapes: Bottom circle x2, Top circle x2

### Text on the board
Top: M12 TAP_AN_ER V1.3 | TOP | E | TEQ NARVAL | D | 2016 | +12V
Bottom: M12 TAP_AN_ER V1.3 | TEQ NARVAL | 2016 | BOT
tNames: E | +5V | GND | D | PGC | CANL | CANH | +12V | MH | SPM | CRM | L_CS | AGND | CS_M | M | CS | m | MCLR | MIC_MUTE | PGD | MUTE | CSIP | L_m | L_M | SP | HP | C_CS | GAIN